# EAGLE design InkTime (EAGLE 9.7.0)

## Sheet 1 of 2
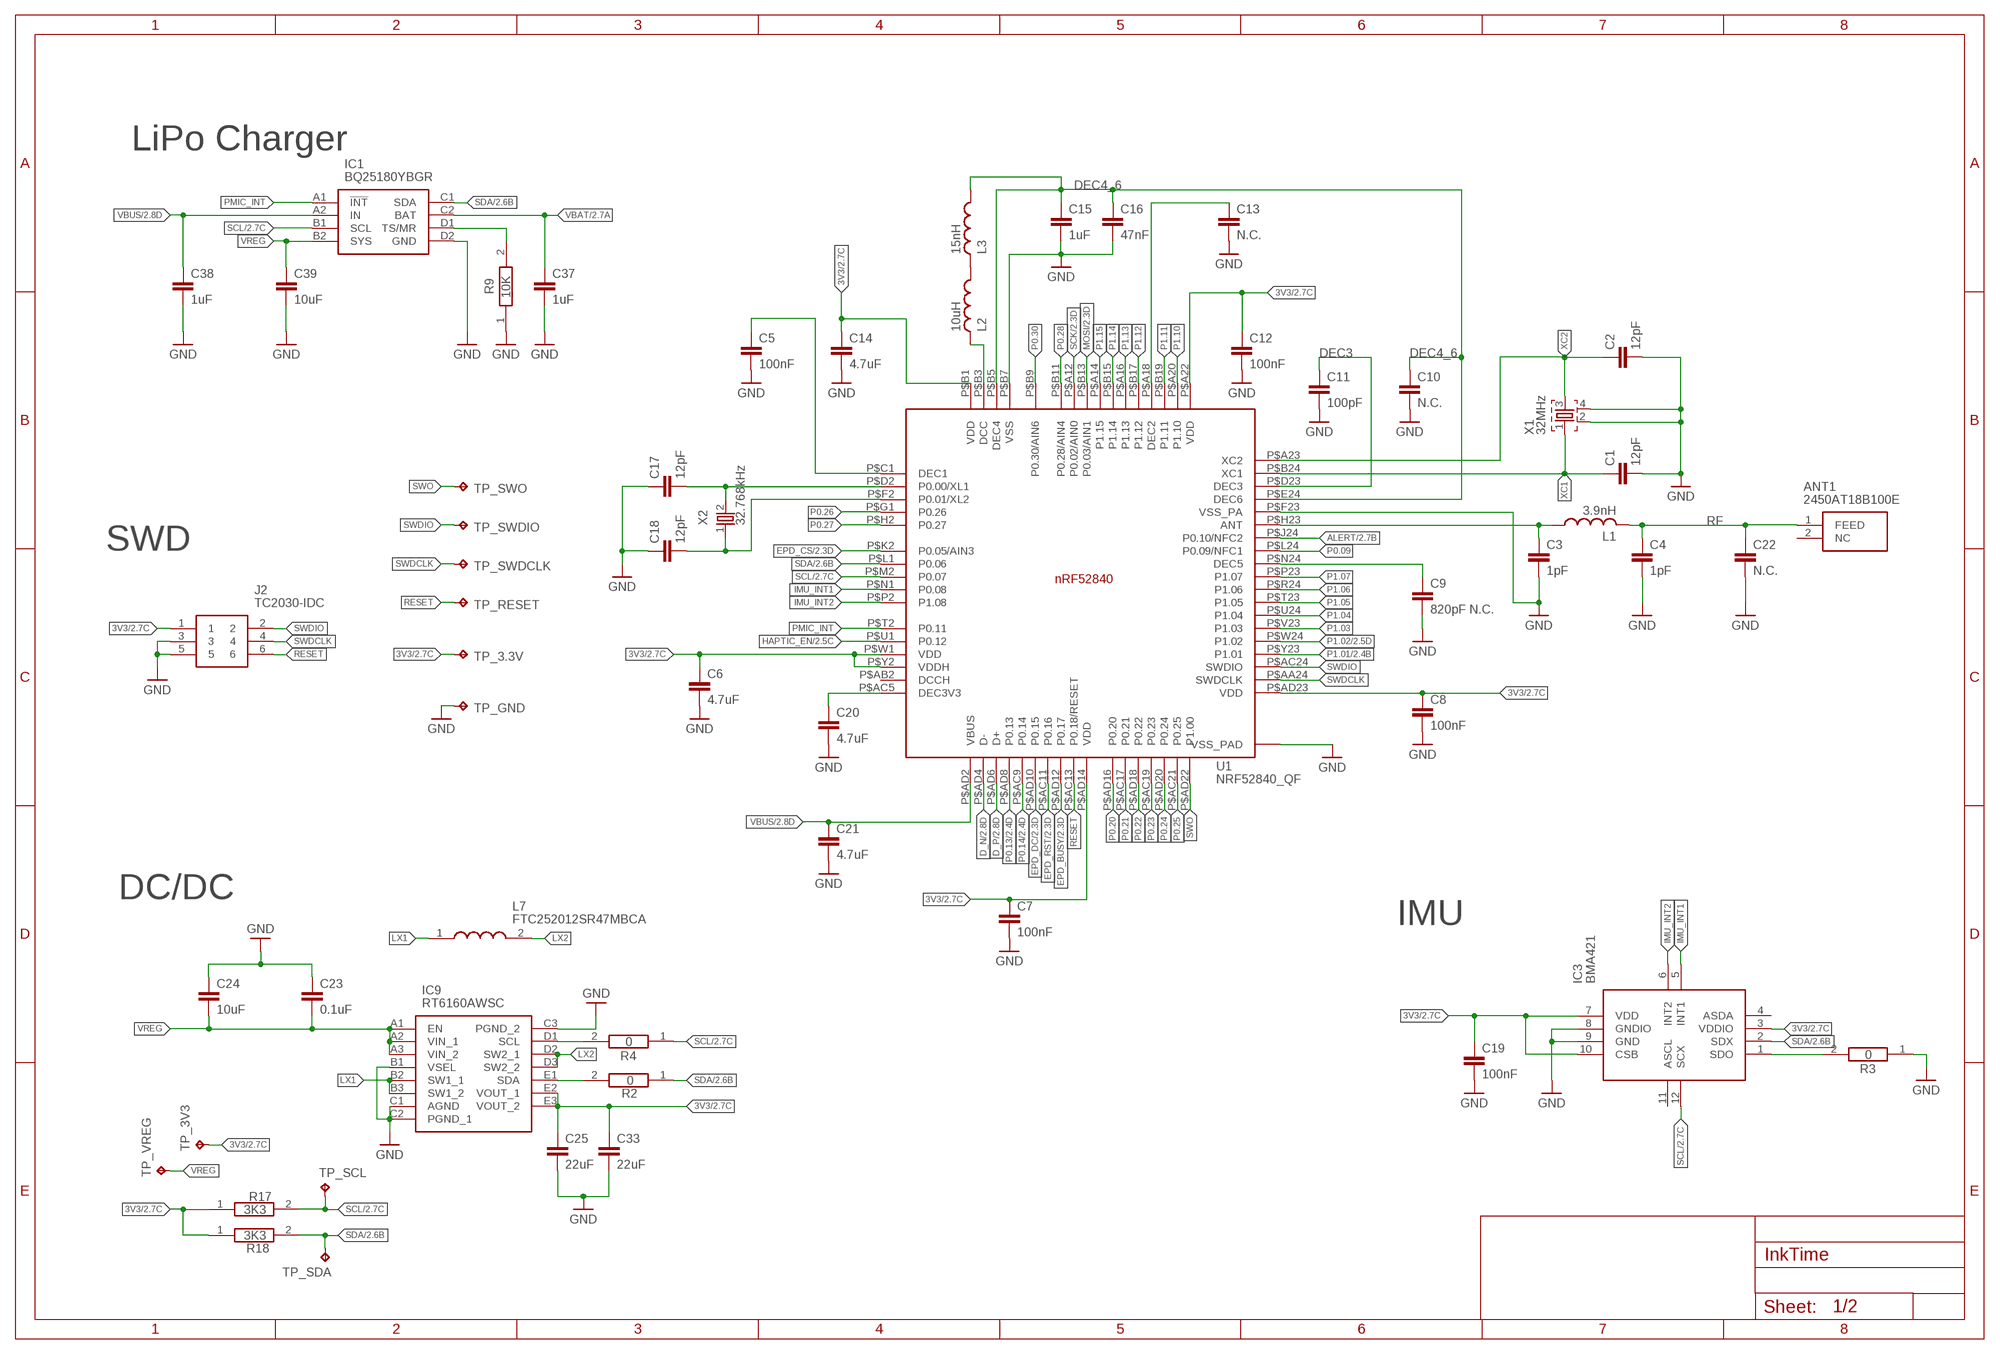
[diagram p0: schematic, sheet 1]

### Parts
ANT1  2450AT18B100E  2450AT18B100E_2450AT18B100E3D  [2450AT18B100E_ANTC3216X140N]
C1  12pF  NORDIC_NRF_3_CAPACITOR_0201_N  [NORDIC_NRF_3_RESC0201_N]
C2  12pF  NORDIC_NRF_3_CAPACITOR_0201_N  [NORDIC_NRF_3_RESC0201_N]
C3  1pF  NORDIC_NRF_3_CAPACITOR_0201_N  [NORDIC_NRF_3_RESC0201_N]
C4  1pF  NORDIC_NRF_3_CAPACITOR_0201_N  [NORDIC_NRF_3_RESC0201_N]
C5  100nF  NORDIC_NRF_3_CAPACITOR_0201_N  [NORDIC_NRF_3_RESC0201_N]
C6  4.7uF  NORDIC_NRF_3_CAPACITOR_0402_N  [NORDIC_NRF_3_RESC0402_N]
C7  100nF  NORDIC_NRF_3_CAPACITOR_0201_N  [NORDIC_NRF_3_RESC0201_N]
C8  100nF  NORDIC_NRF_3_CAPACITOR_0201_N  [NORDIC_NRF_3_RESC0201_N]
C9  820pF N.C.  NORDIC_NRF_3_CAPACITOR_0201_N  [NORDIC_NRF_3_RESC0201_N]
C10  N.C.  NORDIC_NRF_3_CAPACITOR_0201_N  [NORDIC_NRF_3_RESC0201_N]
C11  100pF  NORDIC_NRF_3_CAPACITOR_0201_N  [NORDIC_NRF_3_RESC0201_N]
C12  100nF  NORDIC_NRF_3_CAPACITOR_0201_N  [NORDIC_NRF_3_RESC0201_N]
C13  N.C.  NORDIC_NRF_3_CAPACITOR_0201_N  [NORDIC_NRF_3_RESC0201_N]
C14  4.7uF  NORDIC_NRF_3_CAPACITOR_0402_N  [NORDIC_NRF_3_RESC0402_N]
C15  1uF  NORDIC_NRF_3_CAPACITOR_0402_N  [NORDIC_NRF_3_RESC0402_N]
C16  47nF  NORDIC_NRF_3_CAPACITOR_0201_N  [NORDIC_NRF_3_RESC0201_N]
C17  12pF  NORDIC_NRF_3_CAPACITOR_0201_N  [NORDIC_NRF_3_RESC0201_N]
C18  12pF  NORDIC_NRF_3_CAPACITOR_0201_N  [NORDIC_NRF_3_RESC0201_N]
C19  100nF  NORDIC_NRF_3_CAPACITOR_0201_N  [NORDIC_NRF_3_RESC0201_N]
C20  4.7uF  NORDIC_NRF_3_CAPACITOR_0402_N  [NORDIC_NRF_3_RESC0402_N]
C21  4.7uF  NORDIC_NRF_3_CAPACITOR_0402_N  [NORDIC_NRF_3_RESC0402_N]
C22  N.C.  NORDIC_NRF_3_CAPACITOR_0201_N  [NORDIC_NRF_3_RESC0201_N]
C23  0.1uF  NORDIC_NRF_3_CAPACITOR_0201_N  [NORDIC_NRF_3_RESC0201_N]
C24  10uF  NORDIC_NRF_3_CAPACITOR_0402_N  [NORDIC_NRF_3_RESC0402_N]
C25  22uF  NORDIC_NRF_3_CAPACITOR_0402_N  [NORDIC_NRF_3_RESC0402_N]
C33  22uF  NORDIC_NRF_3_CAPACITOR_0402_N  [NORDIC_NRF_3_RESC0402_N]
C37  1uF  NORDIC_NRF_3_CAPACITOR_0402_N  [NORDIC_NRF_3_RESC0402_N]
C38  1uF  NORDIC_NRF_3_CAPACITOR_0402_N  [NORDIC_NRF_3_RESC0402_N]
C39  10uF  NORDIC_NRF_3_CAPACITOR_0402_N  [NORDIC_NRF_3_RESC0402_N]
IC1  BQ25180YBGR  BQ25180YBGR_BQ25180YBGR  [BQ25180YBGR_BGA8C40P2X4_100X155X50]
IC3  BMA421  BMA421_BMA421  [BMA423_BMA423]
IC9  RT6160AWSC  RT6160AWSC_RT6160AWSC  [RT6160AWSC_BGA15C40P3X5_140X230X60]
J2  TC2030-IDC  TC2030-IDC_TC2030-IDC  [TC2030-IDC_TC2030IDC]
L1  3.9nH  NORDIC_NRF_2_INDUCTOR_0402_N  [NORDIC_NRF_2_RESC0402_N]
L2  10uH  NORDIC_NRF_2_INDUCTOR_0603_N  [NORDIC_NRF_2_RESC0603_N]
L3  15nH  NORDIC_NRF_2_INDUCTOR_0402_N  [NORDIC_NRF_2_RESC0402_N]
L7  FTC252012SR47MBCA  MLP2016SR47MT0S1_FTC252012SR47MBCA  [MLP2016SR47MT0S1_INDC2016X100N]
R2  0  CPF0201D7K68C1_CPF0201D7K68C1  [CPF0201D7K68C1_0201]
R3  0  CPF0201D7K68C1_CPF0201D7K68C1  [CPF0201D7K68C1_0201]
R4  0  CPF0201D7K68C1_CPF0201D7K68C1  [CPF0201D7K68C1_0201]
R9  10K  CPF0201D7K68C1_CPF0201D7K68C1  [CPF0201D7K68C1_0201]
R17  3K3  CPF0201D7K68C1_CPF0201D7K68C1  [CPF0201D7K68C1_0201]
R18  3K3  CPF0201D7K68C1_CPF0201D7K68C1  [CPF0201D7K68C1_0201]
TP_3.3V  HECTOR_WATCH_1_TPTP20R  [HECTOR_WATCH_1_TP20R]
TP_3V3  HECTOR_WATCH_1_TPTP20R  [HECTOR_WATCH_1_TP20R]
TP_GND  HECTOR_WATCH_1_TPTP20R  [HECTOR_WATCH_1_TP20R]
TP_RESET  HECTOR_WATCH_1_TPTP20R  [HECTOR_WATCH_1_TP20R]
TP_SCL  HECTOR_WATCH_1_TPTP20R  [HECTOR_WATCH_1_TP20R]
TP_SDA  HECTOR_WATCH_1_TPTP20R  [HECTOR_WATCH_1_TP20R]
TP_SWDCLK  HECTOR_WATCH_1_TPTP20R  [HECTOR_WATCH_1_TP20R]
TP_SWDIO  HECTOR_WATCH_1_TPTP20R  [HECTOR_WATCH_1_TP20R]
TP_SWO  HECTOR_WATCH_1_TPTP20R  [HECTOR_WATCH_1_TP20R]
TP_VREG  HECTOR_WATCH_1_TPTP20R  [HECTOR_WATCH_1_TP20R]
U1  NRF52840_QF  NORDIC_NRF_4_NRF52840_QF_PINCLEAN2  [NORDIC_NRF_4_AQFN50P700X700X85_HS-74N_PINCLEAN2]
X1  32MHz  NORDIC_NRF_XTAL_32MHZ  [NORDIC_NRF_BT-XTAL_2016_N]
X2  32.768kHz  NORDIC_NRF_1_XTAL_32KHZ  [NORDIC_NRF_1_XTAL_3215_N]

### Nets
3V3 [HIGH_CURRENT]: C6.1 C7.1 C8.1 C12.1 C14.1 C19.1 C25.1 C33.1 IC3.3(VDDIO) IC3.7(VDD) IC3.10(CSB) IC9.E2(VOUT_1) IC9.E3(VOUT_2) J2.1 R17.1 R18.1 TP_3.3V.TP TP_3V3.TP U1.P$A22(VDD) U1.P$AD14(VDD) U1.P$AD23(VDD) U1.P$B1(VDD) U1.P$W1(VDD) U1.P$Y2(VDDH) ; also sheet 2
ALERT: U1.P$J24(P0.10/NFC2) ; also sheet 2
D_N: U1.P$AD4(D-) ; also sheet 2
D_P: U1.P$AD6(D+) ; also sheet 2
DEC3: C11.1 U1.P$D23(DEC3)
DEC4_6: C10.1 C15.1 C16.1 L3.1 U1.P$B5(DEC4) U1.P$E24(DEC6)
EPD_BUSY: U1.P$AD12(P0.17) ; also sheet 2
EPD_CS: U1.P$K2(P0.05/AIN3) ; also sheet 2
EPD_DC: U1.P$AD10(P0.15) ; also sheet 2
EPD_RST: U1.P$AC11(P0.16) ; also sheet 2
GND [GND]: C1.2 C2.2 C3.2 C4.2 C5.2 C6.2 C7.2 C8.2 C9.2 C10.2 C11.2 C12.2 C13.2 C14.2 C15.2 C16.2 C17.1 C18.1 C19.2 C20.2 C21.2 C22.2 C23.1 C24.1 C25.2 C33.2 C37.2 C38.2 C39.2 IC1.D2(GND) IC3.8(GNDIO) IC3.9(GND) IC9.B1(VSEL) IC9.C1(AGND) IC9.C2(PGND_1) IC9.C3(PGND_2) J2.3 J2.5 R3.1 R9.1 TP_GND.TP U1.P$74(VSS_PAD) U1.P$75(VSS_PAD) U1.P$76(VSS_PAD) U1.P$77(VSS_PAD) U1.P$78(VSS_PAD) U1.P$79(VSS_PAD) U1.P$80(VSS_PAD) U1.P$81(VSS_PAD) U1.P$82(VSS_PAD) U1.P$83(VSS_PAD) U1.P$84(VSS_PAD) U1.P$85(VSS_PAD) U1.P$86(VSS_PAD) U1.P$87(VSS_PAD) U1.P$88(VSS_PAD) U1.P$89(VSS_PAD) U1.P$90(VSS_PAD) U1.P$B7(VSS) U1.P$F23(VSS_PA) X1.2 X1.4 ; also sheet 2
HAPTIC_EN: U1.P$U1(P0.12) ; also sheet 2
IMU_INT1: IC3.5(INT1) U1.P$N1(P0.08)
IMU_INT2: IC3.6(INT2) U1.P$P2(P1.08)
LX1: IC9.B2(SW1_1) IC9.B3(SW1_2) L7.1
LX2: IC9.D2(SW2_1) IC9.D3(SW2_2) L7.2
MOSI: U1.P$B13(P0.03/AIN1) ; also sheet 2
N$1: L2.1 L3.2
N$2: L2.2 U1.P$B3(DCC)
N$3: IC1.D1(TS/MR) R9.2
N$4: C3.1 L1.1 U1.P$H23(ANT)
N$7: C9.1 U1.P$N24(DEC5)
N$11: C17.2 U1.P$D2(P0.00/XL1) X2.2
N$12: C5.1 U1.P$C1(DEC1)
N$15: IC9.E1(SDA) R2.2
N$17: C20.1 U1.P$AC5(DEC3V3)
N$18: IC9.D1(SCL) R4.2
N$19: IC3.1(SDO) R3.2
N$20: C18.2 U1.P$F2(P0.01/XL2) X2.1
N$22: C13.1 U1.P$A18(DEC2)
P0.09: U1.P$L24(P0.09/NFC1)
P0.13: U1.P$AD8(P0.13) ; also sheet 2
P0.14: U1.P$AC9(P0.14) ; also sheet 2
P0.20: U1.P$AD16(P0.20)
P0.21: U1.P$AC17(P0.21)
P0.22: U1.P$AD18(P0.22)
P0.23: U1.P$AC19(P0.23)
P0.24: U1.P$AD20(P0.24)
P0.25: U1.P$AC21(P0.25)
P0.26: U1.P$G1(P0.26)
P0.27: U1.P$H2(P0.27)
P0.28: U1.P$B11(P0.28/AIN4)
P0.30: U1.P$B9(P0.30/AIN6)
P1.01: U1.P$Y23(P1.01) ; also sheet 2
P1.02: U1.P$W24(P1.02) ; also sheet 2
P1.03: U1.P$V23(P1.03)
P1.04: U1.P$U24(P1.04)
P1.05: U1.P$T23(P1.05)
P1.06: U1.P$R24(P1.06)
P1.07: U1.P$P23(P1.07)
P1.10: U1.P$A20(P1.10)
P1.11: U1.P$B19(P1.11)
P1.12: U1.P$B17(P1.12)
P1.13: U1.P$A16(P1.13)
P1.14: U1.P$B15(P1.14)
P1.15: U1.P$A14(P1.15)
PMIC_INT: IC1.A1(!INT) U1.P$T2(P0.11)
RESET: J2.6 TP_RESET.TP U1.P$AC13(P0.18/RESET)
RF: ANT1.1(FEED) C4.1 C22.1 L1.2
SCK: U1.P$A12(P0.02/AIN0) ; also sheet 2
SCL: IC1.B1(SCL) IC3.12(SCX) R4.1 R17.2 TP_SCL.TP U1.P$M2(P0.07) ; also sheet 2
SDA: IC1.C1(SDA) IC3.2(SDX) R2.1 R18.2 TP_SDA.TP U1.P$L1(P0.06) ; also sheet 2
SWDCLK: J2.4 TP_SWDCLK.TP U1.P$AA24(SWDCLK)
SWDIO: J2.2 TP_SWDIO.TP U1.P$AC24(SWDIO)
SWO: TP_SWO.TP U1.P$AD22(P1.00)
VBAT [HIGH_CURRENT]: C37.1 IC1.C2(BAT) ; also sheet 2
VBUS [HIGH_CURRENT]: C21.1 C38.1 IC1.A2(IN) U1.P$AD2(VBUS) ; also sheet 2
VREG [HIGH_CURRENT]: C23.2 C24.2 C39.1 IC1.B2(SYS) IC9.A1(EN) IC9.A2(VIN_1) IC9.A3(VIN_2) TP_VREG.TP
XC1: C1.1 U1.P$B24(XC1) X1.1
XC2: C2.1 U1.P$A23(XC2) X1.3
Unconnected: ANT1.2(NC) IC3.4(ASDA) IC3.11(ASCL) U1.P$AB2(DCCH)

### Notes on the sheet
- LiPo Charger
- SWD
- DC/DC
- IMU

## Sheet 2 of 2
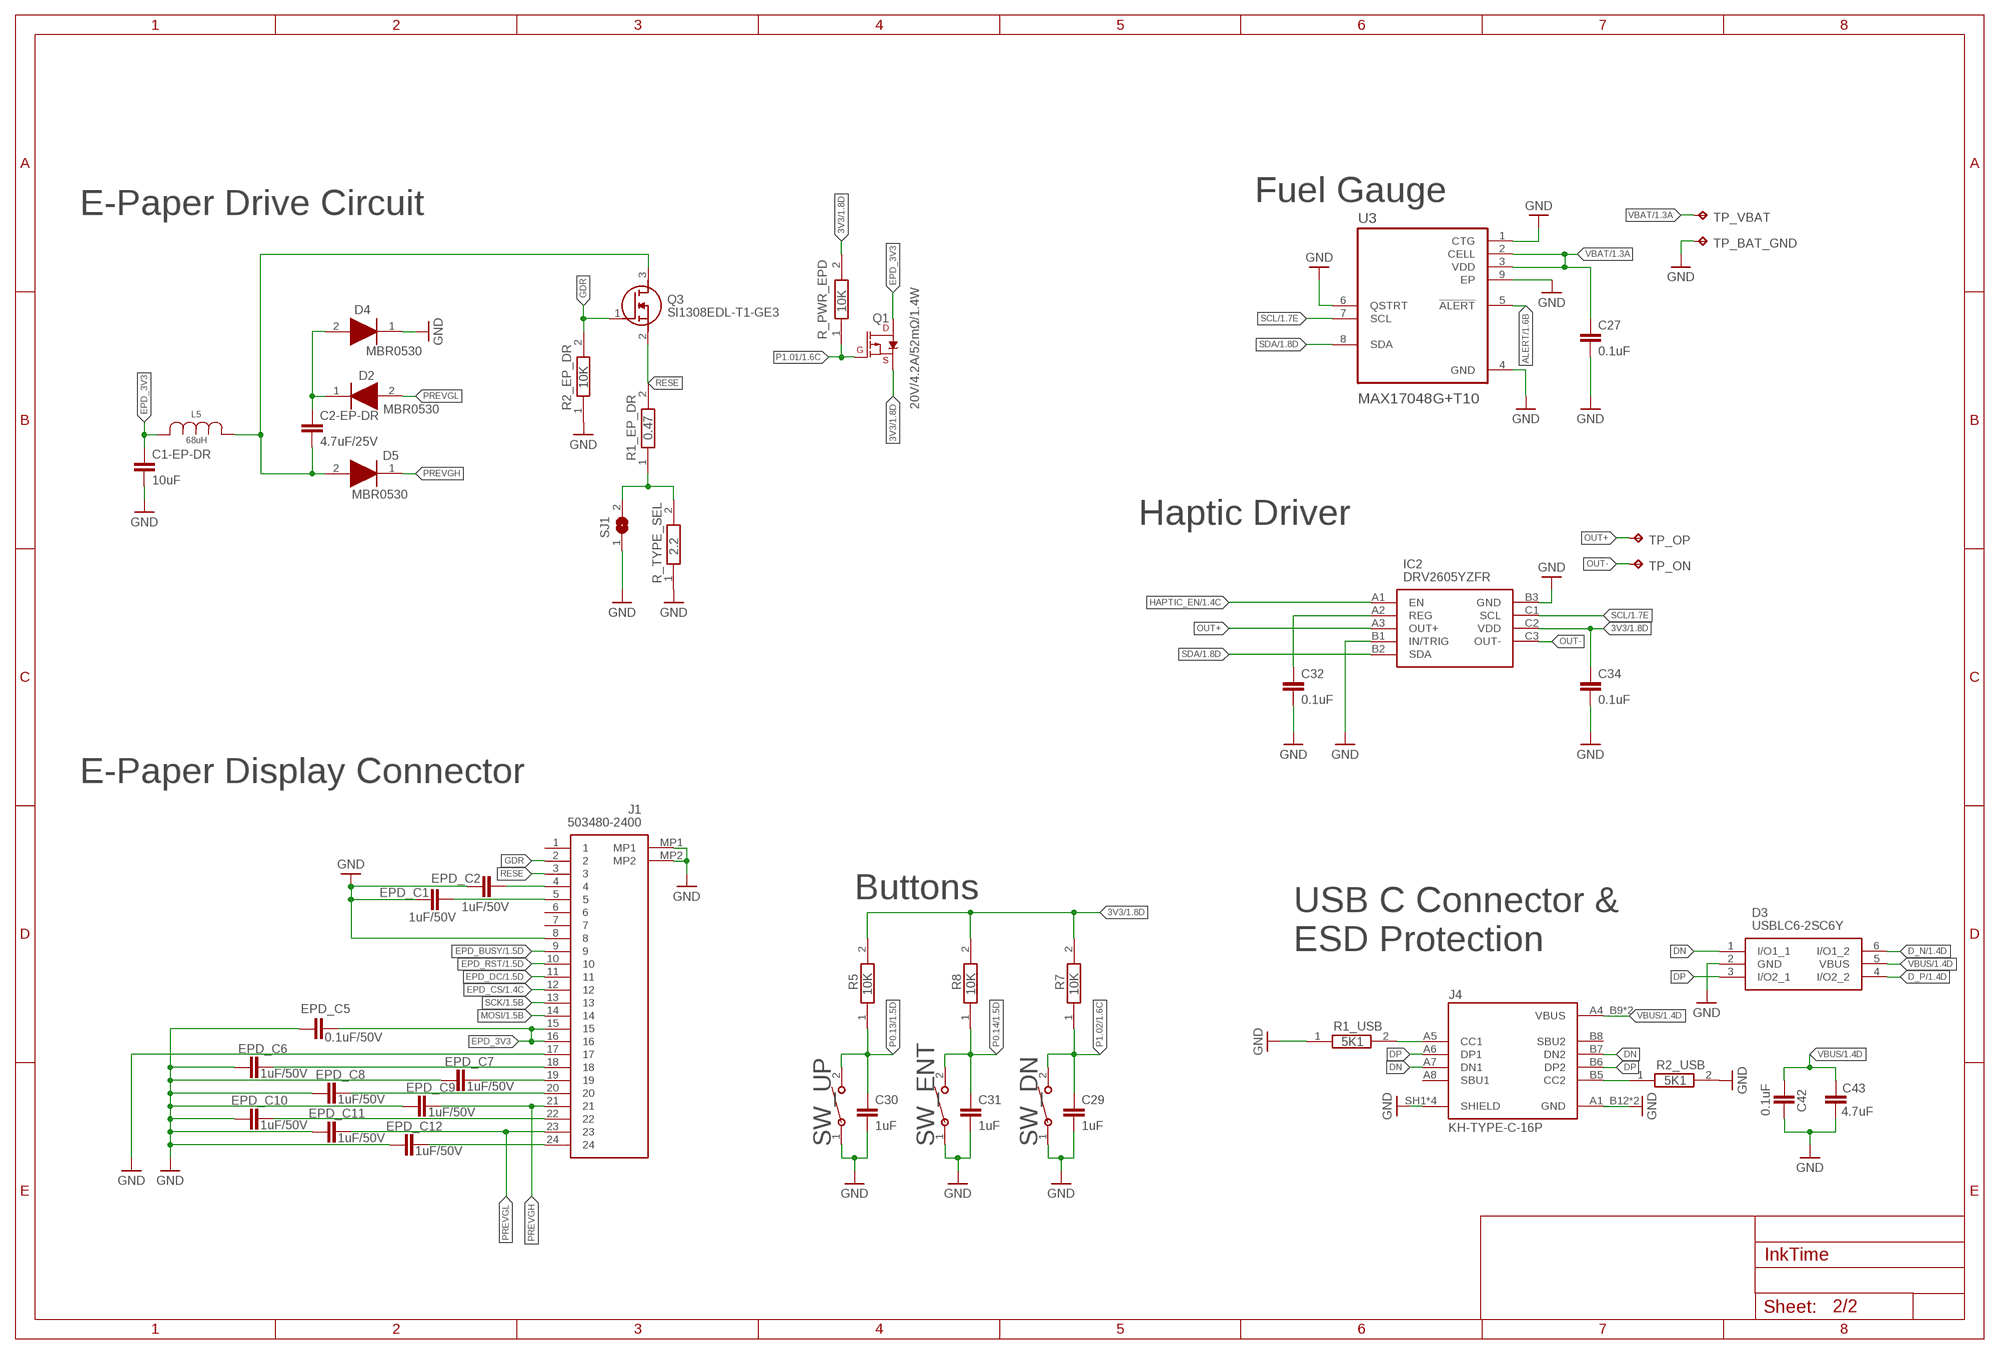
[diagram p1: schematic, sheet 2]

### Parts
C1-EP-DR  10uF  NORDIC_NRF_3_CAPACITOR_0402_N  [NORDIC_NRF_3_RESC0402_N]
C2-EP-DR  4.7uF/25V  NORDIC_NRF_3_CAPACITOR_0402_N  [NORDIC_NRF_3_RESC0402_N]
C27  0.1uF  NORDIC_NRF_3_CAPACITOR_0201_N  [NORDIC_NRF_3_RESC0201_N]
C29  1uF  NORDIC_NRF_3_CAPACITOR_0402_N  [NORDIC_NRF_3_RESC0402_N]
C30  1uF  NORDIC_NRF_3_CAPACITOR_0402_N  [NORDIC_NRF_3_RESC0402_N]
C31  1uF  NORDIC_NRF_3_CAPACITOR_0402_N  [NORDIC_NRF_3_RESC0402_N]
C32  0.1uF  NORDIC_NRF_3_CAPACITOR_0201_N  [NORDIC_NRF_3_RESC0201_N]
C34  0.1uF  NORDIC_NRF_3_CAPACITOR_0201_N  [NORDIC_NRF_3_RESC0201_N]
C42  0.1uF  NORDIC_NRF_3_CAPACITOR_0201_N  [NORDIC_NRF_3_RESC0201_N]
C43  4.7uF  NORDIC_NRF_3_CAPACITOR_0402_N  [NORDIC_NRF_3_RESC0402_N]
D2  MBR0530  ESP32_C6_LIBRARY_5_MBR0530  [ESP32_C6_LIBRARY_5_SOD3716X135N]
D3  USBLC6-2SC6Y  ESP32_C6_LIBRARY_3_USBLC6-2SC6Y  [ESP32_C6_LIBRARY_3_SOT95P280X145-6N]
D4  MBR0530  ESP32_C6_LIBRARY_5_MBR0530  [ESP32_C6_LIBRARY_5_SOD3716X135N]
D5  MBR0530  ESP32_C6_LIBRARY_5_MBR0530  [ESP32_C6_LIBRARY_5_SOD3716X135N]
EPD_C1  1uF/50V  NORDIC_NRF_3_CAPACITOR_0402_N  [NORDIC_NRF_3_RESC0402_N]
EPD_C2  1uF/50V  NORDIC_NRF_3_CAPACITOR_0402_N  [NORDIC_NRF_3_RESC0402_N]
EPD_C5  0.1uF/50V  NORDIC_NRF_3_CAPACITOR_0402_N  [NORDIC_NRF_3_RESC0402_N]
EPD_C6  1uF/50V  NORDIC_NRF_3_CAPACITOR_0402_N  [NORDIC_NRF_3_RESC0402_N]
EPD_C7  1uF/50V  NORDIC_NRF_3_CAPACITOR_0402_N  [NORDIC_NRF_3_RESC0402_N]
EPD_C8  1uF/50V  NORDIC_NRF_3_CAPACITOR_0402_N  [NORDIC_NRF_3_RESC0402_N]
EPD_C9  1uF/50V  NORDIC_NRF_3_CAPACITOR_0402_N  [NORDIC_NRF_3_RESC0402_N]
EPD_C10  1uF/50V  NORDIC_NRF_3_CAPACITOR_0402_N  [NORDIC_NRF_3_RESC0402_N]
EPD_C11  1uF/50V  NORDIC_NRF_3_CAPACITOR_0402_N  [NORDIC_NRF_3_RESC0402_N]
EPD_C12  1uF/50V  NORDIC_NRF_3_CAPACITOR_0402_N  [NORDIC_NRF_3_RESC0402_N]
IC2  DRV2605YZFR  DRV2605YZFR_DRV2605YZFR  [DRV2605YZFR_BGA9C50P3X3_144X144X62]
J1  503480-2400  503480-2400_503480-24003D  [503480-2400_5034802400]
J4  KH-TYPE-C-16P  KH-TYPE-C-16P_KH-TYPE-C-16P  [KH-TYPE-C-16P_KINGHELM_KH-TYPE-C-16P]
L5  68uH  ESP32_C6_LIBRARY_2_744043680IND_4828-WE-TPC_WRE  [ESP32_C6_LIBRARY_2_IND_4828-WE-TPC_WRE]
Q1  20V/4.2A/52mΩ/1.4W  ESP32_C6_LIBRARY_4_ESP32_WROVER_SPARKFUN-DISCRETESEMI_MOSFET_PCH-DMG2305UX-7  [ESP32_C6_LIBRARY_4_ESP32_C6_LIBRARY_4_ESP32_C6_LIBRARY_4_ESP32_C6_LIBRARY_4_ESP32_WROVER_SPARKFUN-DISCRETESEMI_SOT23-3]
Q3  SI1308EDL-T1-GE3  ESP32_C6_LIBRARY_6_SI1308EDL-T1-GE3  [ESP32_C6_LIBRARY_6_SOT65P210X110-3N]
R1_EP_DR  0.47  CPF0201D7K68C1_CPF0201D7K68C1  [CPF0201D7K68C1_0201]
R1_USB  5K1  CPF0201D7K68C1_CPF0201D7K68C1  [CPF0201D7K68C1_0201]
R2_EP_DR  10K  CPF0201D7K68C1_CPF0201D7K68C1  [CPF0201D7K68C1_0201]
R2_USB  5K1  CPF0201D7K68C1_CPF0201D7K68C1  [CPF0201D7K68C1_0201]
R5  10K  CPF0201D7K68C1_CPF0201D7K68C1  [CPF0201D7K68C1_0201]
R7  10K  CPF0201D7K68C1_CPF0201D7K68C1  [CPF0201D7K68C1_0201]
R8  10K  CPF0201D7K68C1_CPF0201D7K68C1  [CPF0201D7K68C1_0201]
R_PWR_EPD  10K  CPF0201D7K68C1_CPF0201D7K68C1  [CPF0201D7K68C1_0201]
R_TYPE_SEL  2.2  CPF0201D7K68C1_CPF0201D7K68C1  [CPF0201D7K68C1_0201]
SJ1  ESP32_C6_LIBRARY_7_JUMPER_SJ  [ESP32_C6_LIBRARY_7_JUMPER_SJ]
SW_DN  2025-10-22_07-23-44_LIBRARY_EVP-AKE31ASW_EVP-AKE31A_PAN  [2025-10-22_07-23-44_LIBRARY_SW_EVP-AKE31A_PAN]
SW_ENT  2025-10-22_07-23-44_LIBRARY_EVP-AKE31ASW_EVP-AKE31A_PAN  [2025-10-22_07-23-44_LIBRARY_SW_EVP-AKE31A_PAN]
SW_UP  2025-10-22_07-23-44_LIBRARY_EVP-AKE31ASW_EVP-AKE31A_PAN  [2025-10-22_07-23-44_LIBRARY_SW_EVP-AKE31A_PAN]
TP_BAT_GND  HECTOR_WATCH_1_TPTP20R  [HECTOR_WATCH_1_TP20R]
TP_ON  HECTOR_WATCH_1_TPTP20R  [HECTOR_WATCH_1_TP20R]
TP_OP  HECTOR_WATCH_1_TPTP20R  [HECTOR_WATCH_1_TP20R]
TP_VBAT  HECTOR_WATCH_1_TPTP20R  [HECTOR_WATCH_1_TP20R]
U3  MAX17048G+T10  ESP32_C6_LIBRARY_MAX17048G+T10  [ESP32_C6_LIBRARY_SON50P200X200X80-9N]

### Nets
3V3 [HIGH_CURRENT]: C34.1 IC2.C2(VDD) Q1.2(S) R5.2 R7.2 R8.2 R_PWR_EPD.2 ; also sheet 1
ALERT: U3.5(!ALERT) ; also sheet 1
D_N: D3.6(I/O1_2) ; also sheet 1
D_P: D3.4(I/O2_2) ; also sheet 1
DN: D3.1(I/O1_1) J4.A7(DN1) J4.B7(DN2)
DP: D3.3(I/O2_1) J4.A6(DP1) J4.B6(DP2)
EPD_3V3 [HIGH_CURRENT]: C1-EP-DR.1 EPD_C5.2 J1.15 J1.16 L5.2 Q1.3(D)
EPD_BUSY: J1.9 ; also sheet 1
EPD_CS: J1.12 ; also sheet 1
EPD_DC: J1.11 ; also sheet 1
EPD_RST: J1.10 ; also sheet 1
GDR: J1.2 Q3.1(G) R2_EP_DR.2
GND [GND]: C1-EP-DR.2 C27.2 C29.2 C30.2 C31.2 C32.2 C34.2 C42.2 C43.2 D3.2(GND) D4.1(K) EPD_C1.1 EPD_C2.1 EPD_C5.1 EPD_C6.1 EPD_C7.1 EPD_C8.1 EPD_C9.1 EPD_C10.1 EPD_C11.1 EPD_C12.1 IC2.B1(IN/TRIG) IC2.B3(GND) J1.8 J1.17 J1.MP1 J1.MP2 J4.A1_B12(GND) J4.A12_B1(GND) J4.SH1(SHIELD) J4.SH2(SHIELD) J4.SH3(SHIELD) J4.SH4(SHIELD) R1_USB.1 R2_EP_DR.1 R2_USB.2 R_TYPE_SEL.1 SJ1.1 SW_DN.1 SW_ENT.1 SW_UP.1 TP_BAT_GND.TP U3.1(CTG) U3.4(GND) U3.6(QSTRT) U3.9(EP) ; also sheet 1
HAPTIC_EN: IC2.A1(EN) ; also sheet 1
MOSI: J1.14 ; also sheet 1
N$5: J4.A5(CC1) R1_USB.2
N$13: EPD_C2.2 J1.4
N$14: R1_EP_DR.1 R_TYPE_SEL.2 SJ1.2
N$16: EPD_C1.2 J1.5
N$21: C2-EP-DR.2 D5.2(A) L5.1 Q3.3(D)
N$23: C32.1 IC2.A2(REG)
N$26: C2-EP-DR.1 D2.1(K) D4.2(A)
N$31: J4.B5(CC2) R2_USB.1
N$34: EPD_C6.2 J1.18
N$36: EPD_C7.2 J1.19
N$37: EPD_C8.2 J1.20
N$41: EPD_C10.2 J1.22
N$45: EPD_C12.2 J1.24
OUT+: IC2.A3(OUT+) TP_OP.TP
OUT-: IC2.C3(OUT-) TP_ON.TP
P0.13: C30.1 R5.1 SW_UP.2 ; also sheet 1
P0.14: C31.1 R8.1 SW_ENT.2 ; also sheet 1
P1.01: Q1.1(G) R_PWR_EPD.1 ; also sheet 1
P1.02: C29.1 R7.1 SW_DN.2 ; also sheet 1
PREVGH: D5.1(K) EPD_C9.2 J1.21
PREVGL: D2.2(A) EPD_C11.2 J1.23
RESE: J1.3 Q3.2(S) R1_EP_DR.2
SCK: J1.13 ; also sheet 1
SCL: IC2.C1(SCL) U3.7(SCL) ; also sheet 1
SDA: IC2.B2(SDA) U3.8(SDA) ; also sheet 1
VBAT [HIGH_CURRENT]: C27.1 TP_VBAT.TP U3.2(CELL) U3.3(VDD) ; also sheet 1
VBUS [HIGH_CURRENT]: C42.1 C43.1 D3.5(VBUS) J4.A4_B9(VBUS) J4.A9_B4(VBUS) ; also sheet 1
Unconnected: J1.1 J1.6 J1.7 J4.A8(SBU1) J4.B8(SBU2)

### Notes on the sheet
- Fuel Gauge
- E-Paper Drive Circuit
- Haptic Driver
- E-Paper Display Connector
- Buttons
- USB C Connector & 
  ESD Protection

## Library data of the parts
ANT1 = InkTime_v5:2450AT18B100E_2450AT18B100E: Antennas 2.45GHz ANTENNA Source: Datasheet <https://www.johansontechnology.com/datasheets/2450AT18B100/2450AT18B100.pdf>
C1 C1-EP-DR C2 C2-EP-DR C3-C25 C27 C29-C34 C37-C39 C42 C43 EPD_C1 EPD_C2 EPD_C5-EPD_C12 = InkTime_v5:NORDIC_NRF_3_CAPACITOR: Generic chip capacitor
D2 D4 D5 = InkTime_v5:ESP32_C6_LIBRARY_5_MBR0530: ON SEMICONDUCTOR - MBR0530 - DIODE, SCHOTTKY, 0.5A, 30V, SOD-123 Source: Datasheet <http://www.onsemi.com/pub/Collateral/MBR0530T1-D.PDF> Check availability <https://pricing.snapeda.com/parts/MBR0530/ON%20Semiconductor/view-part?ref=eda>
D3 = InkTime_v5:ESP32_C6_LIBRARY_3_USBLC6-2SC6Y: Low Cap. ESD Protection Auto SOT-23-6 STMicroelectronics USBLC6-2SC6Y, Dual Uni-Directional TVS Diode Array, 6-Pin SOT-23 Source: Datasheet <https://componentsearchengine.com/Datasheets/1/USBLC6-2SC6Y.pdf> Check availability <https://pricing.snapeda.com/parts/USBLC6-2SC6Y/STMicroelectronics/view-part?ref=eda>
IC1 = InkTime_v5:BQ25180YBGR_BQ25180YBGR: Charger IC Lithium Ion/Polymer, Lithium Iron Phosphate 8-DSBGA (1.6x1.1) Source: Datasheet <https://www.ti.com/lit/ds/symlink/bq25180.pdf?ts=1650264094470&ref_url=https%3A%2F%2Fwww.ti.com%2Fproduct%2FBQ25180>
IC2 = InkTime_v5:DRV2605YZFR_DRV2605YZFR: Haptic Driver for ERM/LRA with Built-In Library and Smart Loop Architecture Source: Datasheet <http://www.ti.com/lit/gpn/drv2605>
IC3 = InkTime_v5:BMA421_BMA421: Accelerometers Triaxial low-g 12bit Acceleration Sensor Source: Datasheet <https://www.mouser.com/datasheet/2/783/BST-BMA423-DS000-1509600.pdf>
IC9 = InkTime_v5:RT6160AWSC_RT6160AWSC: Buck-Boost Regulator Positive Output Step-Up/Step-Down I2C DC-DC Controller IC 15-WL-CSP (BSC) (1.4x2.3) Source: Datasheet <https://www.richtek.com/SaveDownload.aspx?specid=RT6160A>
J1 = InkTime_v5:503480-2400_503480-2400: FFC & FPC Connectors 0.5mm FPC RA SMT Dual Contact 24Ckt Source: Datasheet <https://componentsearchengine.com/Datasheets/1/503480-2400.pdf>
J2 = InkTime_v5:TC2030-IDC_TC2030-IDC: CABLE ADAPTER 6 POS Source: Datasheet <https://datasheet.datasheetarchive.com/originals/distributors/Datasheets_SAMA/62bc384e093448baaaa63dbd0b9d8707.pdf>
J4 = InkTime_v5:KH-TYPE-C-16P_KH-TYPE-C-16P: Check availability <https://pricing.snapeda.com/parts/KH-TYPE-C-16P/kinghelm/view-part?ref=eda>
L1-L3 = InkTime_v5:NORDIC_NRF_2_INDUCTOR: Generic chip inductor
L5 = InkTime_v5:ESP32_C6_LIBRARY_2_744043680
L7 = InkTime_v5:MLP2016SR47MT0S1_FTC252012SR47MBCA: SMD / SMT Inductors (Coils), L=0.47?H, L x W x T : Source: Datasheet <https://product.tdk.com/system/files/dam/doc/product/inductor/inductor/smd/catalog/inductor_commercial_power_mlp2016_en.pdf>
Q1 = InkTime_v5:ESP32_C6_LIBRARY_4_ESP32_WROVER_SPARKFUN-DISCRETESEMI_MOSFET_PCH: P-channel MOSFETs Voltage controlled devices that allow control of high current outputs. SparkFun Products: SparkFun ESP32 Thing <https://www.sparkfun.com/products/13907> SparkFun ESP8266 Thing <https://www.sparkfun.com/products/13231> SparkFun Pi Servo HAT V2 <https://www.sparkfun.com/products/15316> DMG2305UX-7 (20V/4.2A/SOT23-3)
Q3 = InkTime_v5:ESP32_C6_LIBRARY_6_SI1308EDL-T1-GE3: MOSFET N-Ch 30V 1.5A TrenchFET SC70 Vishay Si1308EDL-T1-GE3 N-channel MOSFET Transistor, 1.5 A, 30 V, 3-Pin SC-70 Source: Datasheet <https://componentsearchengine.com/Datasheets/1/SI1308EDL-T1-GE3.pdf> Check availability <https://pricing.snapeda.com/parts/SI1308EDL-T1-GE3/Vishay%20Siliconix/view-part?ref=eda>
R1_EP_DR R1_USB R2 R2_EP_DR R2_USB R3-R5 R7-R9 R17 R18 R_PWR_EPD R_TYPE_SEL = InkTime_v5:CPF0201D7K68C1_CPF0201D7K68C1: 7.68k 0201 Thin Film Surface Mount Fixed Resistor +/-0.5% 0.031W CPF0201D7K68C1 Source: Datasheet <http://www.te.com/commerce/DocumentDelivery/DDEController?Action=showdoc&DocId=Data Sheet1773200-1ApdfEnglishENG_DS_1773200-1_A.pdf4-2176215-6>
SJ1 = InkTime_v5:ESP32_C6_LIBRARY_7_JUMPER_SJ: SMD solder JUMPER
SW_DN SW_ENT SW_UP = InkTime_v5:2025-10-22_07-23-44_LIBRARY_EVP-AKE31A
TP_3.3V TP_3V3 TP_BAT_GND TP_GND TP_ON TP_OP TP_RESET TP_SCL TP_SDA TP_SWDCLK TP_SWDIO TP_SWO TP_VBAT TP_VREG = InkTime_v5:HECTOR_WATCH_1_TP: Test pad
U1 = InkTime_v5:NORDIC_NRF_4_NRF52840_QF_PINCLEAN2: nRF52840 Features Advanced Single chip 2.4 GHz multi-protocol SoC 32-bit ARM Cortex-M4F Processor 1.7v to 5.5v operation 1MB flash + 256kB RAM Bluetooth 5 support for long range and high throughput 802.15.4 radio support On-chip NFC PPI –Programmable Peripheral Interconnect Automated power management system with automatic power management of each peripheral Configurable I/O mapping for analog and digital I/O 48 x GPIO 1 x QSPI 4 x Master/Slave SPI 2 x Two-wire interface (I²C) I²S interface 2 x UART 4 x PWM USB 2.0 controller ARM TrustZone CryptoCell-310 Cryptographic and security module AES 128-bit ECB/CCM/AAR hardware accelerator Digital microphone interface (PDM) Quadrature decoder 12-bit ADC Low power comparator On-chip 50Ω balun On-air compatible with nRF52, nRF51 and nRF24 Series Applications Advanced high performance wearables Wearables for secure payments Virtual Reality/Augmented Reality systems Smart Home sensor networks Smart city sensor networks High performance HID controllers Internet of Things (IoT) sensor networks Smart door locks Smart lighting networks Connected white goods
U3 = InkTime_v5:ESP32_C6_LIBRARY_MAX17048G+T10: Check availability <https://pricing.snapeda.com/parts/MAX17048G%2BT10/Analog%20Devices/view-part?ref=eda>
X1 = InkTime_v5:NORDIC_NRF_XTAL_32MHZ
X2 = InkTime_v5:NORDIC_NRF_1_XTAL_32KHZ

## Board
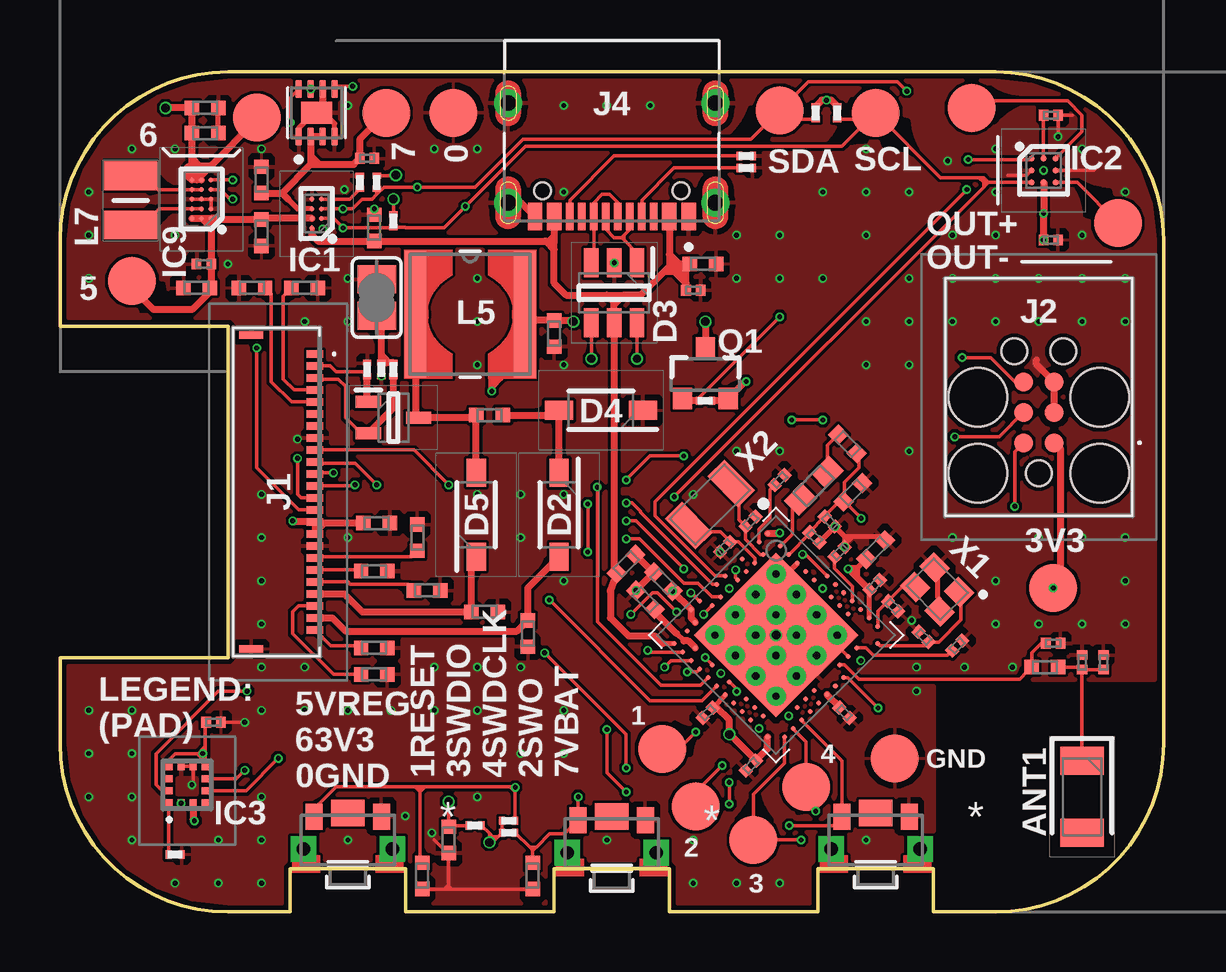
[diagram p2: board, top side]
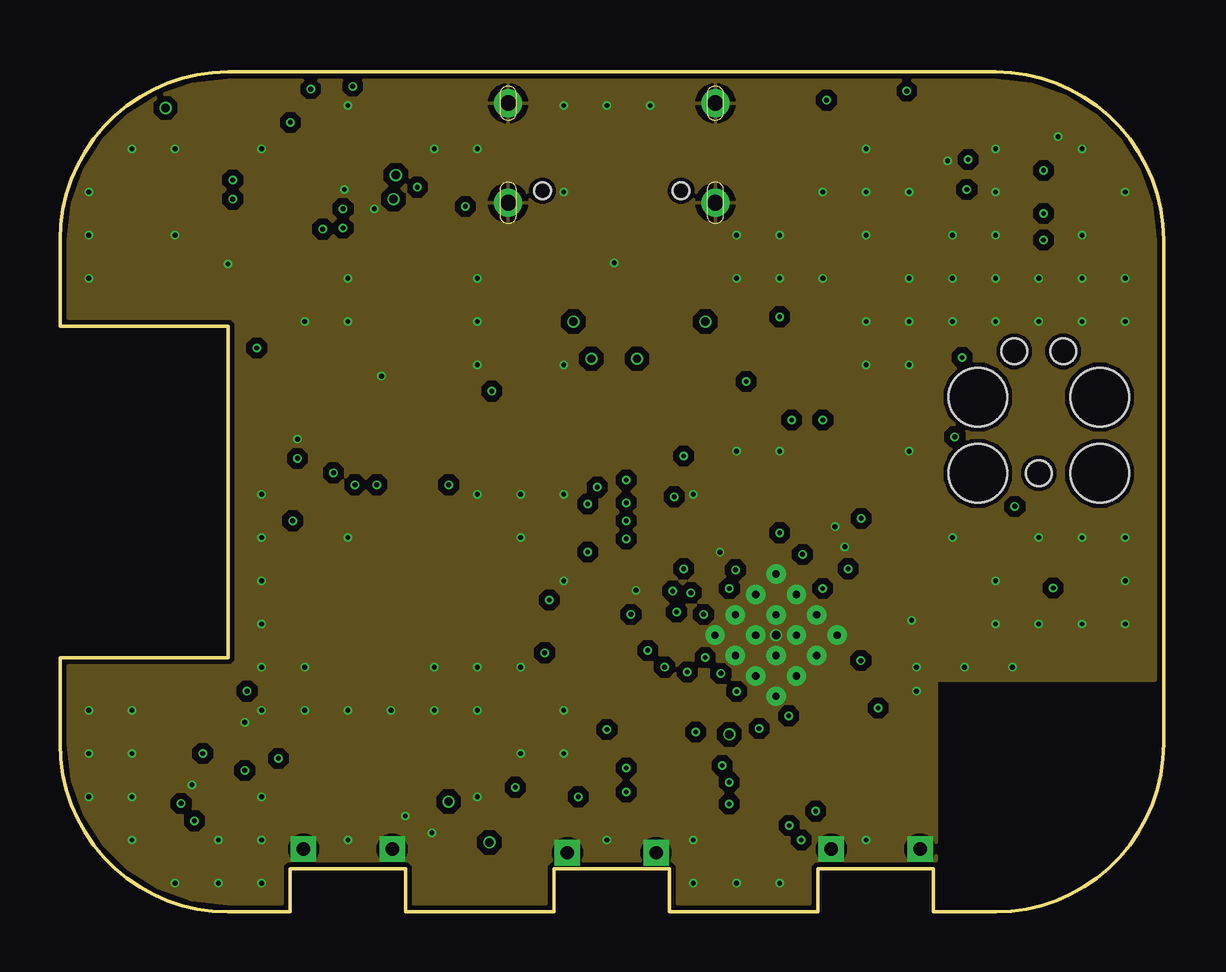
[diagram p3: board, inner layer GND]
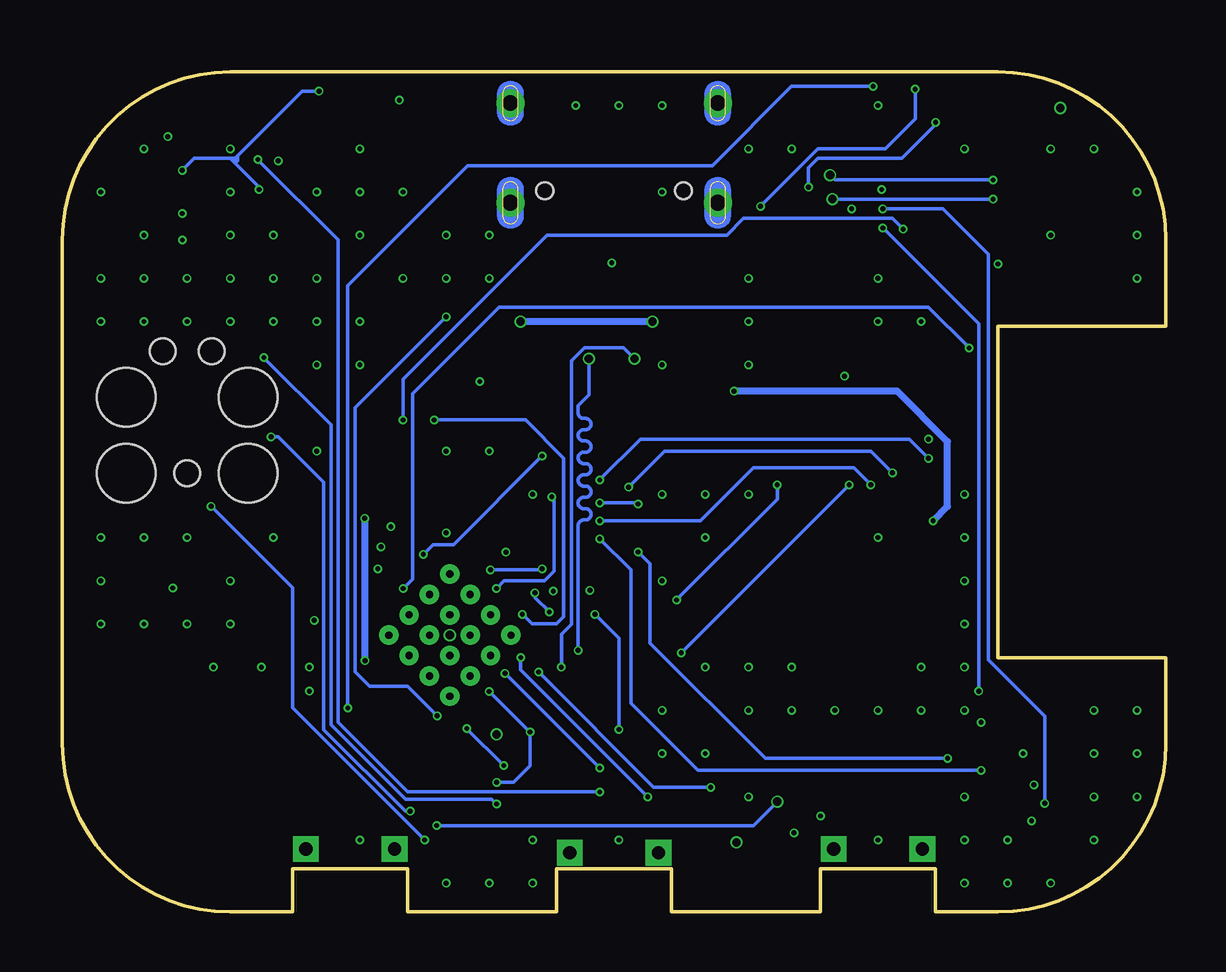
[diagram p4: board, bottom side, seen from below]

Size 46 x 35 mm. Coordinates in mm from the lower left corner, seen from the top.
Outline: 39,0 36.4,0 36.4,1.8 31.6,1.8 31.6,0 25.4,0 25.4,1.8 20.6,1.8 20.6,0 14.4,0 14.4,1.8 9.6,1.8 9.6,0 7,0 arc-90 0,7 0,10.6 7,10.6 7,24.4 0,24.4 0,28 arc-90 7,35 39,35 arc-90 46,28 46,7 arc-90 39,0
Copper layers (1+2*63+16): Top / GND / Bottom / layer 63
Stack-up 4 Layer Stack: Top SilkScreen Epoxy Ink / Top SolderMask SR:Black 0.0254mm Dk 4 / Top Surface Finish Lead-Free 0.02mm / Top User Defined 0.03mm / Dielectric-1 User Defined 0.034mm / Dielectric-2 User Defined 0.034mm / GND User Defined 0.03mm / Dielectric-3 User Defined 0.664mm / Power User Defined 0.03mm / Dielectric-4 User Defined 0.034mm / Dielectric-5 User Defined 0.034mm / Bottom User Defined 0.03mm / Bottom Surface Finish Lead-Free 0.02mm / Bottom SolderMask SR:Black 0.0254mm Dk 4 / Bottom SilkScreen Epoxy Ink
Design rules: minimum drill size 0.2mm, minimum copper width classes=0 && !smd 0.15mm, minimum copper width signal_layers=2,303 && !smd 0.3mm, minimum copper width 5mil, keepout clearance 0mil, drill distance 6mil, via restrict clearance 0mil, dimension clearance 0.2mm, restrict clearance 0mil, copper clearance wire_polygon to wire_polygon 5mil, copper clearance wire_polygon to pad_smd 5mil, copper clearance wire_polygon to via 5mil, copper clearance pad_smd to pad_smd 5mil, copper clearance pad_smd to via 5mil, copper clearance via to via 5mil, copper clearance smd to pad (same net) 5mil, copper clearance smd to via (same net) 5mil, copper clearance smd to smd (same net) 5mil

### Footprints (pad centres in the part's own frame; a part is rotated, then mirrored left to right if it is on the bottom)
2450AT18B100E_ANTC3216X140N = smd 1.15 x 1.8: 1 -1.5,0; 2 1.5,0
NORDIC_NRF_3_RESC0201_N = smd 0.4 x 0.45: 1 -0.305,0; 2 0.305,0
NORDIC_NRF_3_RESC0402_N = smd 0.6 x 0.6: 1 -0.55,0; 2 0.55,0
ESP32_C6_LIBRARY_5_SOD3716X135N = smd 1.15 x 0.8: 1 -1.75,0; 2 1.75,0
ESP32_C6_LIBRARY_3_SOT95P280X145-6N = smd 1.2 x 0.6: 1 -1.25,0.95; 2 -1.25,0; 3 -1.25,-0.95; 4 1.25,-0.95; 5 1.25,0; 6 1.25,0.95
BQ25180YBGR_BGA8C40P2X4_100X155X50 = smd 0.2 x 0.2: A1 -0.2,0.6; A2 0.2,0.6; B1 -0.2,0.2; B2 0.2,0.2; C1 -0.2,-0.2; C2 0.2,-0.2; D1 -0.2,-0.6; D2 0.2,-0.6
DRV2605YZFR_BGA9C50P3X3_144X144X62 = smd 0.25 x 0.25: A1 -0.5,0.5; A2 0,0.5; A3 0.5,0.5; B1 -0.5,0; B2 0,0; B3 0.5,0; C1 -0.5,-0.5; C2 0,-0.5; C3 0.5,-0.5
BMA423_BMA423 = smd 0.3 x 0.35: 1 -0.75,-0.775; 2 -0.25,-0.775; 3 0.25,-0.775; 4 0.75,-0.775; 7 0.75,0.775; 8 0.25,0.775; 9 -0.25,0.775; 10 -0.75,0.775 | smd 0.35 x 0.3: 5 0.775,-0.25; 6 0.775,0.25; 11 -0.775,0.25; 12 -0.775,-0.25
RT6160AWSC_BGA15C40P3X5_140X230X60 = smd 0.216 x 0.216: A1 -0.4,0.8; A2 0,0.8; A3 0.4,0.8; B1 -0.4,0.4; B2 0,0.4; B3 0.4,0.4; C1 -0.4,0; C2 0,0; C3 0.4,0; D1 -0.4,-0.4; D2 0,-0.4; D3 0.4,-0.4; E1 -0.4,-0.8; E2 0,-0.8; E3 0.4,-0.8
503480-2400_5034802400 = smd 0.3 x 0.7: 1 -5.75,1.525; 2 -5.25,1.525; 3 -4.75,1.525; 4 -4.25,1.525; 5 -3.75,1.525; 6 -3.25,1.525; 7 -2.75,1.525; 8 -2.25,1.525; 9 -1.75,1.525; 10 -1.25,1.525; 11 -0.75,1.525; 12 -0.25,1.525; 13 0.25,1.525; 14 0.75,1.525; 15 1.25,1.525; 16 1.75,1.525; 17 2.25,1.525; 18 2.75,1.525; 19 3.25,1.525; 20 3.75,1.525; 21 4.25,1.525; 22 4.75,1.525; 23 5.25,1.525; 24 5.75,1.525 | smd 0.3 x 1: MP1 -6.54,-1.125; MP2 6.54,-1.125
TC2030-IDC_TC2030IDC = smd 0.783 x 0.783: 1 -0.953,-0.635; 2 -0.953,0.635; 3 0.317,-0.635; 4 0.317,0.635; 5 1.588,-0.635; 6 1.588,0.635 | hole 2.451: -2.223,-2.54; -2.223,2.54; 0.952,-2.54; 0.952,2.54 | hole 1.067: -2.223,0; 2.857,-1.016; 2.857,1.016
KH-TYPE-C-16P_KINGHELM_KH-TYPE-C-16P = smd 0.6 x 1.15: A1_B12 -3.2,4.725; A4_B9 -2.4,4.725; A9_B4 2.4,4.725; A12_B1 3.2,4.725 | smd 0.3 x 1.15: A5 -1.25,4.725; A6 -0.25,4.725; A7 0.25,4.725; A8 1.25,4.725; B5 1.75,4.725; B6 0.75,4.725; B7 -0.75,4.725; B8 -1.75,4.725 | drill 0.65 pad 1.05: SH1 -4.32,0; SH2 4.32,0; SH3 -4.32,4.15; SH4 4.32,4.15 | hole 0.7: -2.89,3.65; 2.89,3.65
NORDIC_NRF_2_RESC0402_N = smd 0.6 x 0.6: 1 -0.55,0; 2 0.55,0
NORDIC_NRF_2_RESC0603_N = smd 1.05 x 0.9: 1 -0.8,0; 2 0.8,0
ESP32_C6_LIBRARY_2_IND_4828-WE-TPC_WRE = smd 0.9 x 5.3: 1 -2.286,0; 2 2.286,0
MLP2016SR47MT0S1_INDC2016X100N = smd 1.2 x 2.2: 1 -1.028,0; 2 1.028,0
ESP32_C6_LIBRARY_4_ESP32_C6_LIBRARY_4_ESP32_C6_LIBRARY_4_ESP32_C6_LIBRARY_4_ESP32_WROVER_SPARKFUN-DISCRETESEMI_SOT23-3 = smd 0.8 x 0.9: 1 -0.95,-1; 2 0.95,-1; 3 0,1.1
ESP32_C6_LIBRARY_6_SOT65P210X110-3N = smd 1.05 x 0.5: 1 -1.05,0.65; 2 -1.05,-0.65; 3 1.05,0
CPF0201D7K68C1_0201 = smd 0.35 x 0.25: 1 0,0.275; 2 0,-0.275
ESP32_C6_LIBRARY_7_JUMPER_SJ = smd 1.168 x 1.6: 1 -0.762,0; 2 0.762,0
2025-10-22_07-23-44_LIBRARY_SW_EVP-AKE31A_PAN = smd 0.711 x 1.092: 1 -1.4,-0.972; 2 1.4,-0.972 | drill 0.559 pad 0.914 square: 3 -1.848,0.381; 4 1.848,0.381 | smd 1.397 x 1.092: 5 0,-1.124
HECTOR_WATCH_1_TP20R = smd 2 x 2: TP 0,0
NORDIC_NRF_4_AQFN50P700X700X85_HS-74N_PINCLEAN2 = smd 4.85 x 4.85: P$74 0,0 | drill 0.3 pad 0.6: P$75 -1.8,1.8; P$76 -0.6,1.8; P$77 0.6,1.8; P$78 1.8,1.8; P$79 -1.8,0.6; P$80 -0.6,0.6; P$81 0.6,0.6; P$82 1.8,0.6; P$83 -1.8,-0.6; P$84 -0.6,-0.6; P$85 0.6,-0.6; P$86 1.8,-0.6; P$87 -1.8,-1.8; P$88 -0.6,-1.8; P$89 0.6,-1.8; P$90 1.8,-1.8 | smd 0.2 x 0.2: P$A12 -0.25,3.25; P$A14 0.25,3.25; P$A16 0.75,3.25; P$A18 1.25,3.25; P$A20 1.75,3.25; P$A22 2.25,3.25; P$A23 2.75,3.25; P$AA24 3.25,-2.25; P$AB2 -2.75,-2.5; P$AC5 -2,-2.75; P$AC9 -1,-2.75; P$AC11 -0.5,-2.75; P$AC13 0,-2.75; P$AC17 1,-2.75; P$AC19 1.5,-2.75; P$AC21 2,-2.75; P$AC24 3.25,-2.75; P$AD2 -2.75,-3.25; P$AD4 -2.25,-3.25; P$AD6 -1.75,-3.25; P$AD8 -1.25,-3.25; P$AD10 -0.75,-3.25; P$AD12 -0.25,-3.25; P$AD14 0.25,-3.25; P$AD16 0.75,-3.25; P$AD18 1.25,-3.25; P$AD20 1.75,-3.25; P$AD22 2.25,-3.25; P$AD23 2.75,-3.25; P$B1 -3.25,2.75; P$B3 -2.5,2.75; P$B5 -2,2.75; P$B7 -1.5,2.75; P$B9 -1,2.75; P$B11 -0.5,2.75; P$B13 0,2.75; P$B15 0.5,2.75; P$B17 1,2.75; P$B19 1.5,2.75; P$B24 3.25,2.75; P$C1 -3.25,2.25; P$D2 -2.75,2; P$D23 2.75,2; P$E24 3.25,1.75; P$F2 -2.75,1.5; P$F23 2.75,1.5; P$G1 -3.25,1.25; P$H2 -2.75,1; P$H23 2.75,1; P$J24 3.25,0.75; P$K2 -2.75,0.5; P$L1 -3.25,0.25; P$L24 3.25,0.25; P$M2 -2.75,0; P$N1 -3.25,-0.25; P$N24 3.25,-0.25; P$P2 -2.75,-0.5; P$P23 2.75,-0.5; P$R24 3.25,-0.75; P$T2 -2.75,-1; P$T23 2.75,-1; P$U1 -3.25,-1.25; P$U24 3.25,-1.25; P$V23 2.75,-1.5; P$W1 -3.25,-1.75; P$W24 3.25,-1.75; P$Y2 -2.75,-2; P$Y23 2.75,-2
ESP32_C6_LIBRARY_SON50P200X200X80-9N = smd 0.76 x 0.27: 1 -0.985,0.75; 2 -0.985,0.25; 3 -0.985,-0.25; 4 -0.985,-0.75; 5 0.985,-0.75; 6 0.985,-0.25; 7 0.985,0.25; 8 0.985,0.75 | smd 0.9 x 1.3: 9 0,0
NORDIC_NRF_BT-XTAL_2016_N = smd 0.95 x 0.85: 1 -0.725,-0.575; 2 0.725,-0.575; 3 0.725,0.575; 4 -0.725,0.575
NORDIC_NRF_1_XTAL_3215_N = smd 1 x 1.8: 1 -1.25,0; 2 1.25,0

### Placement (x,y rotation side)
ANT1  42.6,4.8 270 top
C1  36,11.46 135 top
C1-EP-DR  20.6,24.1 270 top
C2  34.73,12.74 315 top
C2-EP-DR  17.9,20.7 180 top
C3  41.4,11.2 0 top
C4  42.6,10.4 90 top
C5  30,18 45 top
C6  25.15,13.77 135 top
C7  27,8.3 225 top
C8  28.8,6.1 225 top
C9  32.7,8.3 315 top
C10  32.09,16.27 315 top
C11  37.4,11.1 45 top
C12  33.97,13.62 45 top
C13  32.5,15 45 top
C14  34,15.1 45 top
C15  33.05,17.48 45 top
C16  31.45,15.61 315 top
C17  28.79,16.27 225 top
C18  27.73,15.21 45 top
C19  6.4,7.9 0 top
C20  24.4,13 135 top
C21  23.6,14.5 45 top
C22  43.5,10.4 90 top
C23  6,27 0 top
C24  5.7,26 0 top
C25  6.05,33.5 0 top
C27  12.8,31.4 0 top
C29  16.2,3 270 top
C30  15.1,1.5 270 top
C31  19.7,1.5 270 top
C32  41.3,33.2 0 top
C33  6.05,32.45 0 top
C34  41.3,28 0 top
C37  8.4,30.5 90 top
C38  13.1,28.5 90 top
C39  8.4,28.3 270 top
C42  26.4,25.9 0 top
C43  26.8,27 0 top
D2  20.8,16.55 270 top
D3  23.1,25.8 270 top
D4  22.55,20.9 180 top
D5  17.35,16.55 90 top
EPD_C1  8,26 0 top
EPD_C2  10.2,26 180 top
EPD_C5  13.2,16.2 180 top
EPD_C6  14.9,15.6 270 top
EPD_C7  13.1,14.2 180 top
EPD_C8  15.3,13.4 180 top
EPD_C9  17.7,12.5 180 top
EPD_C10  13.1,9.9 180 top
EPD_C11  19.5,11.6 90 top
EPD_C12  13.1,11 180 top
IC1  10.7,29.1 180 top
IC2  41,30.9 0 top
IC3  5.3,5.3 0 top
IC9  5.9,29.7 180 top
J1  9.1,17.5 270 top
J2  40.8,20.5 90 top
J4  23,33.7 180 top
L1  41.05,10.2 0 top
L2  31.42,17.76 225 top
L3  32.83,19.5 135 top
L5  17.1,24.9 0 top
L7  2.95,29.65 90 top
Q1  26.9,22.4 0 top
Q3  13.9,20.6 0 top
R1_EP_DR  13.9,22.6 0 top
R1_USB  28.6,31 270 top
R2  13.2,30.4 180 top
R2_EP_DR  12.8,22.6 0 top
R2_USB  28.6,31.5 90 top
R3  4.8,2.4 270 top
R4  13.9,28.8 180 top
R5  18.7,3.8 270 top
R7  17.3,3.6 90 top
R8  18.7,3.3 270 top
R9  12.5,30.4 0 top
R17  32.4,33.3 0 top
R18  31.5,33.3 0 top
R_PWR_EPD  26.9,21.3 90 top
R_TYPE_SEL  13.4,22.6 180 top
SJ1  13.2,25.6 270 top
SW_DN  34,3 180 top
SW_ENT  23,2.85 180 top
SW_UP  12,3 180 top
TP_3.3V  41.4,13.5 0 top
TP_3V3  8.2,33.1 0 top
TP_BAT_GND  16.4,33.3 0 top
TP_GND  34.8,6.4 0 top
TP_ON  44.1,28.7 0 top
TP_OP  38,33.5 0 top
TP_RESET  25.1,6.8 0 top
TP_SCL  34,33.3 0 top
TP_SDA  30,33.4 0 top
TP_SWDCLK  31.1,5.2 0 top
TP_SWDIO  28.9,3 0 top
TP_SWO  26.5,4.4 0 top
TP_VBAT  13.6,33.3 0 top
TP_VREG  3,26.3 0 top
U1  29.85,11.53 315 top
U3  10.7,33.3 90 top
X1  36.57,13.44 135 top
X2  27.09,16.98 45 top

### Tracks (layer width: path | path; a pad name or v marks a point on that pad's centre or on a via)
3V3  (via drill 0.2, 0.35)
  Top 0.15: R5.2 R8.2 18.26,3.14 | 18.26,3.14 18.16,3.04 | R7.2 17.9,3.28 | 18.04,3.04 18.16,3.04 | 17.9,3.28 v17.9,2.9 18.04,3.04 | 17.9,3.28 18.04,3.14 | 18.04,3.14 18.04,3.04 | 18.16,3.04 18.06,3.14 | 18.06,3.14 18.04,3.14 | 18.06,3.14 18.26,3.14 | IC3.10 4.55,6.35 4.8,6.6 5.7,6.6 | 5.7,6.6 5.8,6.5 | 5.8,6.5 6.05,6.25 IC3.7 6.05,6.5 | 6.05,6.5 6.05,6.6 | 6.05,6.6 6.05,6.7 | 6.05,6.7 6.05,6.9 | 6.05,6.9 6.05,7.86 C19.1 | 5.8,6.5 6.05,6.5 | 5.75,6.6 v5.95,6.6 | v5.95,6.6 6.05,6.7 | 5.7,6.6 5.75,6.6 | 5.75,6.6 6.05,6.9 | 6.05,6.6 v5.95,6.6
  Top 0.2: U1.P$A22 33.74,13.4 C12.1 | v32.86,14.3 v32.85,14.3 | U1.P$AD14 27.73,9.03 C7.1 | C14.1 | C14.1 33.2,14.3
  Top 0.3: U1.P$AD23 29.5,6.79 C8.1 27.93,7.4 v27.9,7.4 27.9,8 27.38,8.52 C7.1 | U1.P$B1 29.98,15.78 v30,15.8 | C12.1 33.2,13.96 | 33.2,13.96 v32.86,14.3 33.2,14.3 33.2,13.96 | U1.P$Y2 26.31,12.24 U1.P$W1 v25.54,13.37 C6.1 | 5.7,30.5 IC9.E3 | IC9.E3 5.5,30.7 | 5.5,30.7 5.5,31.15 | 5.5,31.2 5.5,31.4 | 5.5,31.4 C33.1 C25.1 v4.4,33.5 | 5.7,30.5 5.5,30.7 | IC9.E3 5.35,30.65 | 5.35,30.65 5.3,30.7 5.3,31 5.5,31.2 | IC2.C2 v41,29.1 C34.1 | R_PWR_EPD.2 27.75,21.3 Q1.2 28.55,22.1 v28.6,22.1 | 5.7,30.5 6.05,30.85 | 6.05,30.85 6.3,31.1 | 6.3,31.1 8.2,33 TP_3V3.TP | 5.35,30.65 5.55,30.85 5.8,30.85 | 5.8,30.85 6.05,30.85 | 5.8,30.85 5.5,31.15 | 5.5,31.15 5.5,31.2 | 5.5,31.4 5.8,31.1 6.3,31.1 | IC9.E2 5.7,30.5 | R17.1 32.15,33.83 v31.95,33.83 31.75,33.83 R18.1 | IC3.3 5.55,3.85 v5.6,3.8 | J2.1 41.7,19.28 41.7,13.8 TP_3.3V.TP
  other vias: 41.4,13.5 41,28
  pour Power: -1.3,36.6 -1.9,36 -1.9,-2.2 -1.7,-2.4 49.2,-2.4 49.2,35.9 49.9,36.6
ALERT  (via drill 0.2)
  Top 0.15: U3.5 11.56,34.4 v12.2,34.4 | v34.1,8.5 32.83,9.77 U1.P$J24
  Bottom 0.15: v12.2,34.4 15.6,34.4 18.9,31.1 29.1,31.1 34.1,26.1 v34.1,8.5
D_N  (via drill 0.2, 0.35)
  Top 0.15: U1.P$AD4 24.57,10.83 v24.5,10.9 | D3.6 v24.05,23.05
  Bottom 0.15: v24.5,10.9 24.5,16.1 arc90 24.27,16.34 24.2,16.34 arc-90 23.96,16.57 arc-90 24.2,16.81 24.27,16.81 arc90 24.5,17.04 arc90 24.27,17.28 24.2,17.28 arc-90 23.96,17.51 arc-90 24.2,17.75 24.27,17.75 arc90 24.5,17.98 arc90 24.27,18.22 24.2,18.22 arc-90 23.96,18.45 arc-90 24.2,18.68 24.27,18.68 arc90 24.5,18.92 arc90 24.27,19.16 24.2,19.16 arc-90 23.96,19.39 arc-90 24.2,19.62 24.27,19.62 arc90 24.5,19.86 arc90 24.27,20.09 24.2,20.09 arc-90 23.96,20.33 arc-90 24.2,20.57 24.27,20.57 arc90 24.5,20.8 24.5,21.1 24.05,21.55 v24.05,23.05
D_P  (via drill 0.2, 0.35)
  Top 0.15: U1.P$AD6 25.47,10.47 v25.2,10.2 | D3.4 v22.15,23.05
  Bottom 0.15: v25.2,10.2 25.2,11.57 24.78,11.99 24.78,22.96 24.24,23.5 22.6,23.5 v22.15,23.05
DEC3
  Top 0.15: U1.P$D23 33.6,11 33.9,10.7 37,10.7 C11.1
DEC4_6  (via drill 0.2)
  Top 0.15: C15.1 32.41,17.03 C10.1 31.87,16.46 C16.1 31.24,15.75 U1.P$B5 | v33.4,16.4 32.7,17.1 C15.1 | C15.1 32.7,17.13 32.7,17.9 33.3,18.5 33.3,18.8 33.22,18.88 L3.1
  Bottom 0.3: U1.P$E24 33.38,16.38 v33.4,16.4
  other vias: 33.38,10.47
DN
  Top 0.15: J4.A7 22.75,28.45 23.1,28.1 23.4,28.1 | 23.5,28.2 23.75,28.45 J4.B7 | 23.5,28.2 23.4,28.1 | 23.4,28.1 23.5,28 | 23.5,28 24.05,27.45 D3.1 | 23.5,28 23.5,28.2
DP
  Top 0.15: D3.3 22.25,27.15 J4.B6 22.25,29.55 22.6,29.9 22.9,29.9 23.25,29.55 J4.A6
EPD_3V3  (via drill 0.2, 0.35)
  Top 0.3: EPD_C5.2 11,16.2 | 11,16.2 10.68,16.2 J1.15 | J1.15 J1.16 10.62,15.82 11,16.2 | 19.3,24.6 19.3,23.2 18.35,22.25 | 19.3,24.6 19.3,24.81 L5.2 | 19.3,24.6 19.35,24.65 C1-EP-DR.1 21.35,24.65 v21.4,24.6 | v26.9,24.6 Q1.3 | J1.15 9.75,16.25 v9.7,16.3 | v18,21.7 18,21.9 | 18.35,22.25 18,21.9 | 18,21.9 18,22.6 18.35,22.25
  Bottom 0.3: v21.4,24.6 v26.9,24.6 | v9.7,16.3 9.1,16.9 9.1,19.6 11.2,21.7 v18,21.7
EPD_BUSY  (via drill 0.2)
  Top 0.15: v16.2,17.8 14.75,19.25 J1.9 | U1.P$AD12 26.76,8.8 24.6,8.8 v20.4,13
  Bottom 0.15: v16.2,17.8 16.2,17.2 v20.4,13
EPD_CS  (via drill 0.2)
  Top 0.15: v28.16,14.26 28.16,13.93 U1.P$K2 | v26,14.3 24,16.3 v23.6,16.3 | v12.3,17.8 12.25,17.75 J1.12
  Bottom 0.15: v28.16,14.26 26.04,14.26 v26,14.3 | v23.6,16.3 19.4,16.3 17.2,18.5 13,18.5 v12.3,17.8
EPD_DC  (via drill 0.2)
  Top 0.15: v11.4,18.3 10.68,18.3 J1.11 | U1.P$AD10 26.72,9.47 26.7,9.45 25.05,9.45 22.4,12.1 v22.4,17.7
  Bottom 0.15: v22.4,17.7 20.9,19.2 12.3,19.2 v11.4,18.3
EPD_RST  (via drill 0.2)
  Top 0.15: v13.2,17.8 12.3,18.7 10.68,18.7 J1.10 | v20.2,10.8 23.6,7.4 v23.6,6
  Bottom 0.15: U1.P$AC11 v23.61,6 v23.6,6 | v13.2,17.8 v20.2,10.8
  other vias: 27.55,9.94
GDR
  Top 0.15: J1.2 11.25,22.75 11.5,22.5 12.62,22.5 R2_EP_DR.2
  Top 0.3: Q3.1 12.8,21.3 R2_EP_DR.2
GND  (via drill 0.2, 0.35)
  Top 0.15: IC9.B1 IC9.C1 IC9.C2 IC9.C3 | C30.2 16,0.95 | 16,0.95 16.2,0.95 | 16.2,0.95 16.35,0.95 | C31.2 16.35,0.95 | 16.2,1.1 C29.2 16.15,2.45 15.6,3 | 16.2,1.1 16.2,0.95 | 16,0.95 16.15,1.1 16.2,1.1 | 16.35,0.95 16.2,1.1 | U1.P$F23 32.39,11.11 U1.P$78 | IC2.B3 43.1,30.9 43.4,31.2 | 42.2,33.2 C32.2 v41.61,32.3 | C38.2 v13.1,29.3 | 5.5,6.03 IC3.8 | IC3.9 IC3.8 | IC3.8 5.55,5.35 v5.5,5.3 | C19.2 v7.7,7.9 | IC2.B1 40.3,30.7 39.5,30.7
  Top 0.2: U3.1 9.95,32.65 10.6,33.3 U3.9 | U3.4 11.45,32.85 10.85,33.45 | C33.2 C25.2 | C16.2 31.67,15.42 C10.2 32.72,15.64 | U1.P$B7 30.27,14.08 U1.P$75 | 32.72,15.64 C13.2 32.72,15.36 33,15.64 | C14.2 34.23,15.64 33,15.64 | 33,15.64 32.72,15.64 | X1.4 36.67,13.03 36.6,13.1 36.6,14.22 X1.2
  Top 0.3: U3.6 10.95,33.55 10.85,33.45 U3.9 | C21.2 24.72,14.15 C6.2 v24.01,13.4 C20.2 | J2.3 J2.5 40.7,22.82 40.7,23 | J4.SH4 19.23,29.55 J4.A12_B1
  other vias: 39.7,10.2 11.85,30.1 35.7,10.2 35.7,9.2 37.7,10.2 27.51,14.99 32.3,16.06 32.72,15.22 9.9,19.7 14.4,4 15.5,3.3 37,31.3 35.5,12.15 7,27 13.4,22.32 23.1,27.05 29.85,11.53 24.6,33.6 22.8,33.6 21,33.6 39,31.8 33.6,31.8 15.6,31.8 8.4,31.8 44.4,30 39,30 33.6,30 31.8,30 17.4,31.8 42.6,31.8 42.6,28.2 42.6,26.4 39,26.4 35.4,26.4 28.2,26.4 1.2,26.4 37.2,28.2 44.4,24.6 37.2,26.4 40.8,24.6 39,24.6 35.4,24.6 28.2,28.2 10.2,24.6 33.6,28.2 35.4,22.8 30,26.4 3,31.8 28.2,19.2 17.4,24.6 40.8,15.6 37.2,15.6 44.4,26.4 12,26.4 8.4,4.8 40.8,12 26.4,3 44.4,13.8 1.2,30 26.4,17.4 39,28.2 17.4,17.4 21,13.8 39,13.8 42.6,12 17.4,4.8 39,12 12,24.6 17.4,22.8 8.4,12 3,3 42.6,24.6 12,15.6 8.4,17.4 1.2,28.2 30,28.2 44.4,15.6 4.8,1.2 44.4,12 13.8,8.4 10.2,8.4 3,8.4 10.2,10.2 12,33.6 30,19.2 12,8.4 1.2,8.4 8.4,8.4 21,22.8 19.2,17.4 33.6,24.6 4.8,31.8 19.2,10.2 8.4,15.6 22.8,3 15.6,10.2 8.4,13.8 1.2,4.8 35.4,19.2 21,6.6 8.4,3 21,8.4 17.4,8.4 33.6,3 35.4,30 8.4,1.2 17.4,10.2 19.2,6.6 21,17.4 4.8,28.2 42.6,15.6 21,30 3,6.6 6.6,3 30,1.2 17.4,26.4 28.2,1.2 15.6,8.4 31.8,26.4 3,4.8 40.8,26.4 37.2,24.6 33.6,22.8 19.2,15.6 8.4,10.2 1.2,6.6 26.4,1.2 12,3 6.6,1.2
  pour GND: -2.3,37.1 62.9,37.1 62.9,-2.3 -1.8,-2.3 -1.8,36.6
  pour Top: -4.7,38.5 -4.7,-5.5 -3.8,-6.4 65,-6.4 66,-5.4 66,37.3 65.4,37.9 -4.1,37.9
HAPTIC_EN  (via drill 0.2)
  Top 0.15: U1.P$U1 26.31,13.3 v26.3,13.3 | v25.7,12.5 24.9,13.3 24.7,13.3 v23.8,12.4 | v22.8,7.6 22.8,5.8 v23.6,5 | IC2.A1 40.45,31.35 v37.85,31.35
  Bottom 0.15: v26.3,13.3 26.3,13.1 v25.7,12.5 | v23.8,12.4 22.8,11.4 v22.8,7.6 | v23.6,5 31.6,5 34.5,7.9 34.5,28 v37.85,31.35
IMU_INT1  (via drill 0.2)
  Top 0.15: U1.P$N1 27.2,13.65 24.2,16.65 24.2,16.7 23.85,17.05 v23.6,17.05 | IC3.5 7.75,5.05 v9.1,6.4 | v22,15 v22,17
  Bottom 0.15: v9.1,6.4 16.7,6.4 21.5,11.2 21.5,14.5 v22,15 | v22,17 22.05,17.05 v23.6,17.05
IMU_INT2  (via drill 0.2)
  Top 0.15: v23.6,15.55 24.15,15.55 26,13.7 26.6,13.7 27.18,13.12 U1.P$P2 | v7.7,5.9 7.35,5.55 IC3.6
  Bottom 0.15: v23.6,15.55 22.3,14.25 22.3,12.2 22.3,12.1 22.3,8.7 19.5,5.9 v7.7,5.9
LX1
  Top 0.15: L7.1 3.45,28.62 4.13,29.3 IC9.B3 IC9.B2
LX2
  Top 0.15: L7.2 3.52,30.68 4.1,30.1 IC9.D3 IC9.D2
MOSI  (via drill 0.2)
  Top 0.15: J1.14 9.95,16.75 8.2,18.5 v8.2,23.5
  Bottom 0.15: v8.2,23.5 9.9,25.2 27.8,25.2 31.4,21.6 31.4,13.87 U1.P$B13
  other vias: 31.79,13.48
N$1
  Top 0.15: L2.1 31.99,19.44 L3.2 | L3.2
N$2
  Top 0.15: U1.P$B3 30.52,15.75 30.52,16.86 L2.2
N$3
  Top 0.15: IC1.D1 12.07,29.7 R9.2
N$4
  Top 0.15: U1.P$H23 32.7,10.3 33.3,9.7 40,9.7 40.3,10 40.35,10.05 L1.1 40.5,10.8 40.9,11.2 C3.1
N$5
  Top 0.15: J4.A5 24.25,29.65 25.6,31 R1_USB.2
N$7
  Top 0.3: U1.P$N24 32.48,8.54 C9.1
N$11
  Top 0.15: X2.2 28.29,17.54 28.29,16.34 C17.2 28.57,15.53 29.21,14.89 U1.P$D2
N$12
  Top 0.15: U1.P$C1 29.14,15.94 29.6,16.4 29.6,17.6 C5.1
N$13
  Top 0.15: J1.4 9.75,21.75 9.3,22.2 9.3,25.65 EPD_C2.2
N$14
  Top 0.3: R1_EP_DR.1 13.6,22.88 | 13.6,22.88 R_TYPE_SEL.2 13.4,23.2 | 13.4,23.2 13.4,24.64 SJ1.2 | 13.6,22.88 13.6,23 13.4,23.2
N$15  (via drill 0.2, 0.35)
  Top 0.15: IC9.E1 v7.2,30.5 | v14,30.7 13.97,30.68 R2.2
  Bottom 0.15: v7.2,30.5 13.8,30.5 v14,30.7
N$16
  Top 0.15: J1.5 9.65,21.25 8.8,22.1 8.8,25.75 EPD_C1.2
N$17
  Top 0.2: 26,11.3 25.7,11.6
  Top 0.3: U1.P$AC5 26.19,11.3 26,11.3 | 25.7,11.6 24.77,12.53 C20.1
N$18  (via drill 0.2, 0.35)
  Top 0.15: IC9.D1 6.7,30.1 7.1,29.7 v7.2,29.7 | v13.9,29.7 R4.2
  Bottom 0.15: v7.2,29.7 v13.9,29.7
N$19
  Top 0.15: R3.2 4.52,4.5 IC3.1
N$20
  Top 0.15: U1.P$F2 28.96,14.74 28.27,15.43 C18.2 27.52,15.85 26.6,15.85 26.35,16.09 X2.1
N$21
  Top 0.3: D5.2 C2-EP-DR.2 17.25,20.6 Q3.3 14.81,20.74 L5.1
N$22
  Top 0.15: U1.P$A18 33.03,13.57 32.28,14.32 C13.1
N$23
  Top 0.15: IC2.A2 C32.1
N$26
  Top 0.3: D2.1 D4.2 20.6,20.7 C2-EP-DR.1
N$31
  Top 0.15: J4.B5 21.25,29.65 23.1,31.5 R2_USB.1
N$34
  Top 0.15: EPD_C6.2 14.65,14.8 10.68,14.8 J1.18
N$36
  Top 0.15: J1.19 12.5,14.25 EPD_C7.2
N$37
  Top 0.15: J1.20 12,13.75 12.1,13.65 14.15,13.65 14.5,13.65 EPD_C8.2
N$41
  Top 0.15: J1.22 9.95,12.75 9.7,12.5 9.7,11.6 11.4,9.9 EPD_C10.2
N$45
  Top 0.15: J1.24 11.28,11.1 12.45,11.1 EPD_C12.2
OUT+
  Top 0.15: IC2.A3 42.6,32.5 42.6,33.2 42,33.8 38.3,33.8 TP_OP.TP
OUT-
  Top 0.15: IC2.C3 42.4,30.4 TP_ON.TP
P0.13  (via drill 0.2)
  Top 0.15: SW_UP.2 10.6,4.3 11.52,5.22 14.8,5.22 | 18.76,5.22 18.95,5.22 v18.98,5.19 18.98,5 | 15,5.22 15.22,5.22 | 15.22,5.22 18.76,5.22 | 15,5.22 14.8,5.22 | R5.1 18.98,5 | C30.1 15,2.15 15,5 | 15,5.02 15,5.22 | U1.P$AD8 26.55,10 v26.15,10 | 18.76,5.22 18.98,5 | 15,5 15.22,5.22 | 15,5 15,5.02 | 15,5.02 14.8,5.22
  Bottom 0.15: v26.15,10 21.35,5.2 v18.98,5.2 v18.98,5.19
P0.14  (via drill 0.2)
  Top 0.15: v21.6,4.8 SW_ENT.2 21.03,3.25 20.4,3.25 19.88,2.72 19.84,2.69 | v21.6,4.8 | U1.P$AC9 v26.89,10.6 | C31.1 19.7,2.55 | 19.7,2.55 19.84,2.69 | 19.7,2.55 19.7,2.57 19.59,2.69 | 19.59,2.69 R8.1 | 19.59,2.69 19.84,2.69
  Bottom 0.15: v26.89,10.6 26.89,10.09 v21.6,4.8
P1.01  (via drill 0.2)
  Top 0.15: v30,24.8 26.5,21.3 26.05,21.3
  Top 0.3: R_PWR_EPD.1 26.05,21.3 Q1.1
  Bottom 0.15: U1.P$Y23 30.6,8.4 30.7,8.5 31.6,9.4 33.2,9.4 33.8,10 33.8,21 v30,24.8
  other vias: 30.38,8.17
P1.02  (via drill 0.2, 0.35)
  Top 0.15: U1.P$W24 32.6,6.31 SW_DN.2 32.23,3.6 v30.4,3.6 | v16.2,4.6 C29.1 16.25,3.6 R7.1
  Bottom 0.15: v30.4,3.6 17.2,3.6 v16.2,4.6
PMIC_INT  (via drill 0.2)
  Top 0.15: U1.P$T2 v26.83,12.4 | v30.5,20.5 v31.8,20.5 | v10.95,28.45 IC1.A1
  Bottom 0.15: v10.95,28.45 11.4,28.9 17.6,28.9 18.3,28.2 25.8,28.2 31.8,22.2 v31.8,20.5 | v30.5,20.5 26.7,20.5 25.1,18.9 25.1,12.3 25.4,12 26.43,12 v26.83,12.4
PREVGH
  Top 0.3: J1.21 11.85,13.25 12.6,12.5 EPD_C9.2 17.15,14.6 D5.1
PREVGL
  Top 0.3: J1.23 11.35,12.25 11.9,11.7 19.05,11.7 EPD_C11.2 19.5,13.5 D2.2
RESE
  Top 0.15: J1.3 10.68,22.2 11.6,22.2 11.9,21.9 11.9,20.6 12.55,19.95 Q3.2
  Top 0.3: Q3.2 13.9,21 R1_EP_DR.2
RESET  (via drill 0.2)
  Top 0.15: v26.5,7.5 25.9,6.9 25.2,6.9 TP_RESET.TP | v27.9,5.4 v27.9,4.5 | v37.6,23.1 38.8,23.1 39.81,22.09 J2.6 | U1.P$AC13 28.21,9.28 v28.21,9.19
  Bottom 0.15: v28.21,9.19 26.52,7.5 v26.5,7.5 26.5,6.1 27.2,5.4 v27.9,5.4 | v27.9,4.5 28.1,4.7 31.7,4.7 34.8,7.8 34.8,20.3 v37.6,23.1
RF
  Top 0.15: L1.2 42.5,10.2 C4.1 | C4.1 C22.1 | C4.1 ANT1.1
SCK  (via drill 0.2)
  Top 0.15: v26,19 24.6,19 v23.6,18 | J1.13 10.05,17.25 9.9,17.4 v9.9,18.9 | U1.P$A12 31.08,14.9 v30.95,14.9
  Bottom 0.15: v26,19 29.7,15.3 30.55,15.3 v30.95,14.9 | v23.6,18 21.9,19.7 10.7,19.7 v9.9,18.9
SCL  (via drill 0.2)
  Top 0.15: 33.73,33.02 32.6,31.9 19.4,31.9 v16.9,29.4 16,28.5 14.4,28.5 14.38,28.52 R4.1 13.88,28.5 v11.8,28.5 11.4,28.9 IC1.B1 | 33.73,33.02 TP_SCL.TP 36.7,30.6 38.3,30.6 | R17.2 33.73,33.02 | v25.6,17.3 38.5,30.2 | 38.6,30.3 38.7,30.4 | 38.7,30.4 IC2.C1 | 38.5,30.6 38.6,30.5 | 38.6,30.5 38.7,30.4 | 38.5,30.2 38.5,30.4 | 38.5,30.4 38.5,30.6 | v7.8,9.2 6.6,9.2 4,6.6 4,5.3 4.25,5.05 IC3.12 | 38.6,30.5 38.6,30.3 | 38.6,30.3 38.5,30.2 | 38.3,30.6 38.5,30.6 | 38.3,30.6 38.5,30.4
  Bottom 0.15: U1.P$M2 27.58,13.8 25.9,13.8 25.5,14.2 25.5,17.2 v25.6,17.3 | v11.8,28.5 7.8,24.5 v7.8,9.2 | v16.9,29.4 14.5,31.8 11.7,31.8 10.45,33.05 U3.7
  other vias: 27.9,13.48 10.45,34.28
SDA  (via drill 0.2)
  Top 0.15: IC1.C1 v11.8,29.3 12.2,29.3 12.6,29.7 13,29.7 13.2,29.9 | 13.2,29.9 R2.1 | 13.2,29.9 13.5,30.2 v14.9,30.2 17.3,30.2 19.3,32.2 28.8,32.2 29.95,33.35 | 29.95,33.35 TP_SDA.TP 31.2,34.6 34.9,34.6 v35.3,34.2 | R18.2 30.27,33.02 29.95,33.35 | U1.P$L1 27.29,14.01 24.8,16.5 24.8,17.1 v37.8,30.1 | v9.6,32.9 9.6,33.94 U3.8
  Bottom 0.15: IC3.2 5.05,8.15 7.4,10.5 7.4,27.4 9.3,29.3 v11.8,29.3 | v14.9,30.2 14.9,31 14.5,31.4 11,31.4 9.6,32.8 v9.6,32.9 | IC2.B2 40.5,31.4 39,31.4 | 39,31.4 38.8,31.2 | 38.8,31.2 37.8,30.2 v37.8,30.1 | 39,31.4 38.8,31.4 | 38.8,31.4 38.7,31.5 | 38.7,31.5 36,34.2 v35.3,34.2 | 38.8,31.2 38.7,31.3 38.7,31.5 | 38.8,31.2 38.8,31.4
  other vias: 41,30.9 5.05,4.53
SWDCLK  (via drill 0.2)
  Top 0.15: U1.P$AA24 31.1,7.1 TP_SWDCLK.TP 31.5,4.8 v31.5,4.2 | v37.3,19.8 39.15,19.8 J2.4
  Bottom 0.15: v31.5,4.2 31.7,4.2 35.1,7.6 35.1,17.9 37,19.8 v37.3,19.8
SWDIO  (via drill 0.2)
  Top 0.15: U1.P$AC24 30.2,6.2 28.9,4.9 TP_SWDIO.TP v30.9,3 | v39.8,16.9 39.8,19.18 J2.2
  Bottom 0.15: v30.9,3 36.4,8.5 36.4,13.5 v39.8,16.9
SWO  (via drill 0.2)
  Top 0.15: TP_SWO.TP 26.5,5 v27.6,6.1
  Bottom 0.15: U1.P$AD22 v27.6,6.1
  other vias: 29.14,7.64
VBAT
  Top 0.2: IC1.C2 9.9,29.3 9.5,29.7
  Top 0.3: 9.5,29.7 9.25,29.95 | C37.1 9.25,29.95 | 9.25,29.95 10.45,31.15 | 10.45,31.5 U3.2 U3.3 | 10.45,31.5 10.45,31.15 | 10.45,31.15 10.8,31.15 | 10.8,31.15 12.24,31.15 C27.1 12.49,32.2 TP_VBAT.TP | 10.8,31.15 10.45,31.5
VBUS
  Top 0.2: U1.P$AD2 25.12,11.18 | IC1.A2 10.5,28.2 | 20.55,27.95 20.35,27.95 20.6,28.2
  Top 0.3: J4.A4_B9 25.4,27.4 | 25.4,27.4 25.4,26.9 | 25.2,26.7 24.2,25.7 23.5,25.7 | 25.2,26.7 25.4,26.9 | 23.5,25.7 23.1,25.3 | 23.1,25.3 D3.5 23.1,14.22 C21.1 23.21,13.93 23.11,13.83 22.94,13.36 22.94,12.26 23.7,11.5 24.8,11.5 25.12,11.18 | 22.8,25.7 23.5,25.7 | 23.1,25.3 23.1,25.4 22.8,25.7 | 22.8,25.7 21.1,25.7 20.6,26.2 20.6,27.6 | J4.A9_B4 20.6,28.2 20.6,27.9 | 25.4,26.9 25.5,27 25.8,27 | 25.8,27 C43.1 26.09,26.84 | 25.4,26.9 25.6,26.7 | 25.6,26.7 26.09,26.2 | C42.1 26.09,26.2 | 26.09,26.84 25.95,26.7 25.6,26.7 | 26.09,26.2 26.09,26.84 | 25.8,27 25.4,27.4 | 25.2,26.7 25.6,26.7 | 20.25,27.95 20.55,27.95 20.6,27.9 | 10.5,28.2 10.75,27.95 C38.1 20.2,27.95 20.25,27.95 | 20.6,27.6 20.6,27.9 | 20.25,27.95 20.6,27.6
VREG
  Top 0.3: IC9.A3 IC9.A2 | IC9.A2 IC9.A1 | 6.3,28.49 C23.2 6.3,26.05 C24.2 6.25,25.85 5.5,25.1 3.9,25.1 3,26 TP_VREG.TP | IC9.A2 6.3,28.49 | IC9.A1 6.3,28.49 | 6.6,28.9 IC9.A1 | 6.3,28.49 6.6,28.79 6.6,28.9 | IC1.B2 8.45,28.9 C39.1 6.65,28.85 6.6,28.9
XC1
  Top 0.15: 36.63,11.25 37.56,12.17 37.56,13.27 X1.1 | U1.P$B24 34.17,11.1 36.07,11.1 C1.1 36.63,11.25 | 36.63,11.25
XC2
  Top 0.15: U1.P$A23 34.09,12.53 C2.1 | X1.3 35.11,13.55 C2.1 | C2.1
(copper drawn outside any net)
  shapes: Bottom area x1, GND area x1, Top area x1

### Text on the board
SilkscreenTop: 6 | 7 | 0 | SDA | SCL | OUT+ | OUT- | 5 | L5 | 3V3 | LEGEND: / (PAD) | 1 | 4 | 1RESET / 3SWDIO / 4SWDCLK / 2SWO / 7VBAT | GND | 5VREG / 63V3 / 0GND | 2 | 3